# Altium project Metlino.PrjPcb (part 10 of 13)

## Sheet MCH_FPGA_Banks_44_45_46_DDR64.SchDoc: Metlino
size 420 x 297 mm; CheckedBy: P.Kulik,T.Przywozki,W.Ruclo; Author: G.Kasprowicz; CompanyName: WUT ISE; DrawnBy: G.Kasprowicz; Organization: WUT ISE; Address1: PW ISE; Address2: Nowowiejska 15/19 00-665 Warsaw; Address3: gkasprow@gmail.com; DocumentNumber: 3; Revision: 2; SheetNumber: 3; SheetTotal: 29; ModifiedBy: -; CheckedDate: -; Title2: FPGA banks -  SDRAM; DivGrp: WUT ISE; Designer: G.Kasprowicz; ModifiedDate: -; ProjectName: Sensor Box
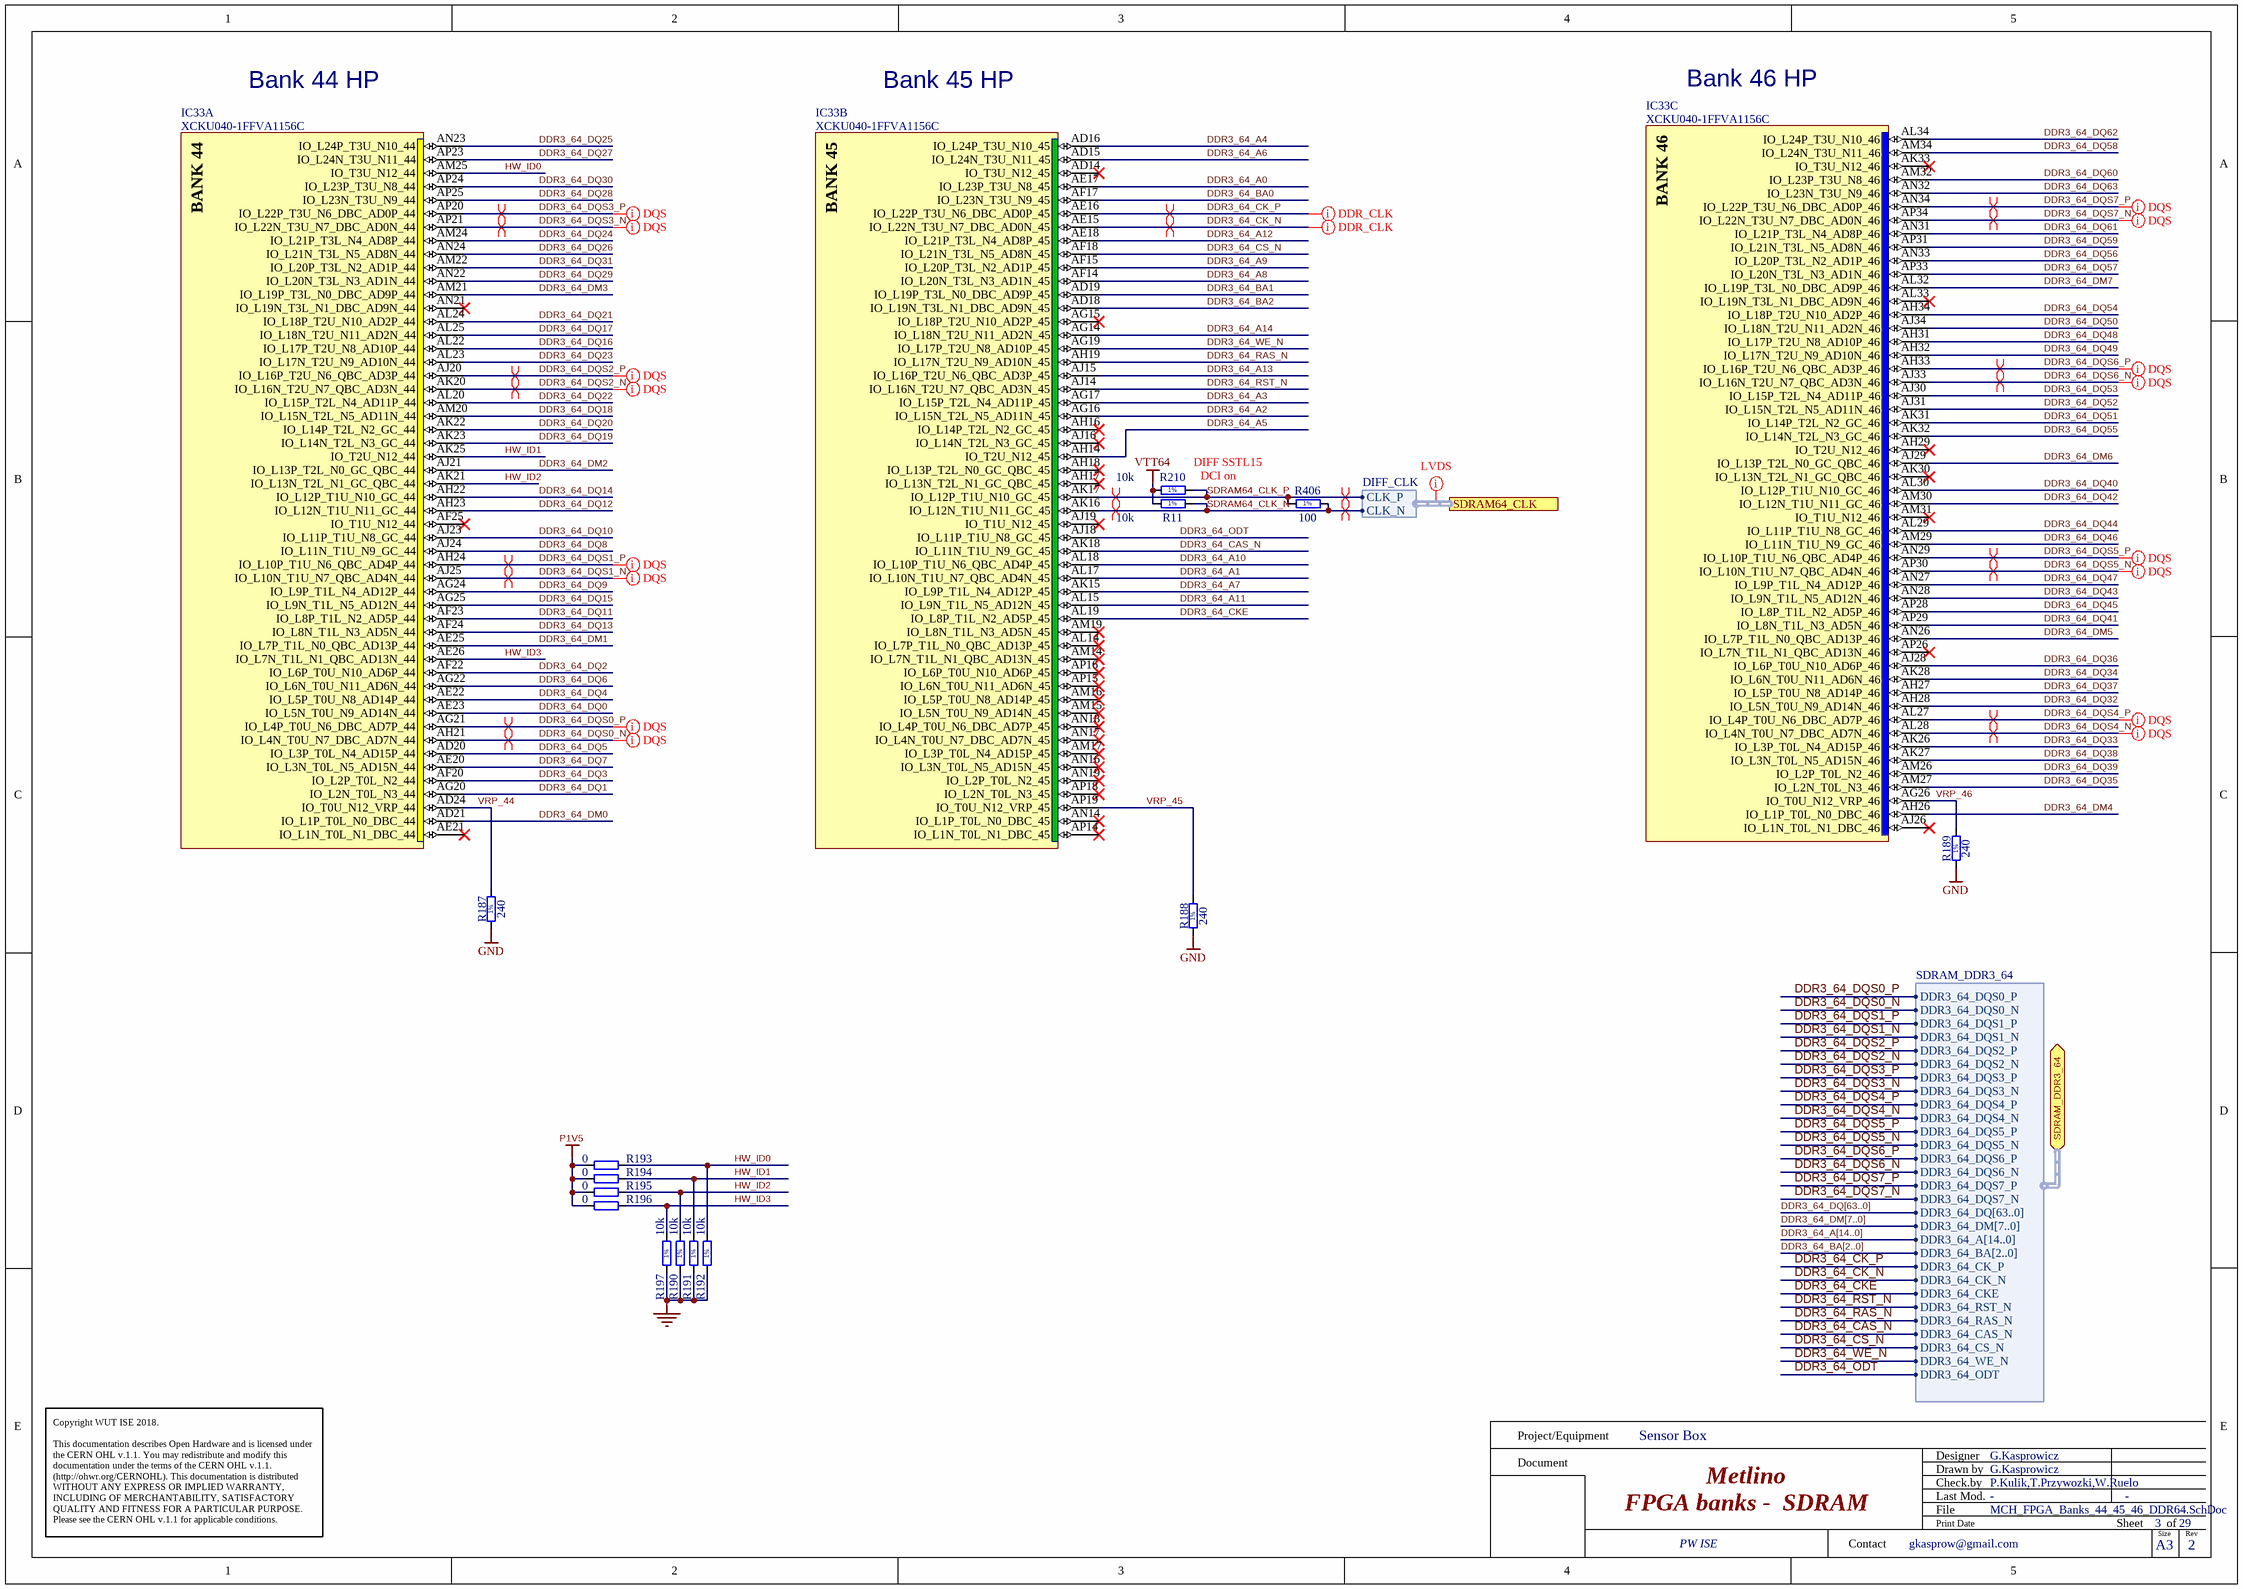
[diagram p20: MCH_FPGA_Banks_44_45_46_DDR64.SchDoc]

### Parts
IC33  XCKU040-1FFVA1156C  [BGA1156C100P34X34_3500X3500X350]  (parts A,B,C of 22)
R11  10k  [RESC1005X40N]
R187  240  [RESC1005X40N]
R188  240  [RESC1005X40N]
R189  240  [RESC1005X40N]
R190  10k  [RESC1005X40N]
R191  10k  [RESC1005X40N]
R192  10k  [RESC1005X40N]
R193  0  [RESC1005X40N]
R194  0  [RESC1005X40N]
R195  0  [RESC1005X40N]
R196  0  [RESC1005X40N]
R197  10k  [RESC1005X40N]
R210  10k  [RESC1005X40N]
R406  100  [RESC0603X28N]

### Ports
SDRAM64_CLK (harness DIFF_CLK), SDRAM_DDR3_64 (bidir, harness SDRAM_DDR3_64)

### Harnesses
SDRAM_DDR3_64: DDR3_64_DQS0_P, DDR3_64_DQS0_N, DDR3_64_DQS1_P, DDR3_64_DQS1_N, DDR3_64_DQS2_P, DDR3_64_DQS2_N, DDR3_64_DQS3_P, DDR3_64_DQS3_N, DDR3_64_DQS4_P, DDR3_64_DQS4_N, DDR3_64_DQS5_P, DDR3_64_DQS5_N, DDR3_64_DQS6_P, DDR3_64_DQS6_N, DDR3_64_DQS7_P, DDR3_64_DQS7_N, DDR3_64_DQ[63..0], DDR3_64_DM[7..0], DDR3_64_A[14..0], DDR3_64_BA[2..0], DDR3_64_CK_P, DDR3_64_CK_N, DDR3_64_CKE, DDR3_64_RST_N, DDR3_64_RAS_N, DDR3_64_CAS_N, DDR3_64_CS_N, DDR3_64_WE_N, DDR3_64_ODT
DIFF_CLK: CLK_N, CLK_P

### Nets
GND: R187.1 R188.1 R189.1 R190.1 R191.1 R192.1 R197.1
P1V5: R193.1 R194.1 R195.1 R196.1
VTT64: R11.1 R210.1
DDR3_64_A0: IC33.AE17(IO_L23P_T3U_N8_45)
DDR3_64_A1: IC33.AL17(IO_L10N_T1U_N7_QBC_AD4N_45)
DDR3_64_A2: IC33.AG16(IO_L15N_T2L_N5_AD11N_45)
DDR3_64_A3: IC33.AG17(IO_L15P_T2L_N4_AD11P_45)
DDR3_64_A4: IC33.AD16(IO_L24P_T3U_N10_45)
DDR3_64_A5: IC33.AH14(IO_T2U_N12_45)
DDR3_64_A6: IC33.AD15(IO_L24N_T3U_N11_45)
DDR3_64_A7: IC33.AK15(IO_L9P_T1L_N4_AD12P_45)
DDR3_64_A8: IC33.AF14(IO_L20N_T3L_N3_AD1N_45)
DDR3_64_A9: IC33.AF15(IO_L20P_T3L_N2_AD1P_45)
DDR3_64_A10: IC33.AL18(IO_L10P_T1U_N6_QBC_AD4P_45)
DDR3_64_A11: IC33.AL15(IO_L9N_T1L_N5_AD12N_45)
DDR3_64_A12: IC33.AE18(IO_L21P_T3L_N4_AD8P_45)
DDR3_64_A13: IC33.AJ15(IO_L16P_T2U_N6_QBC_AD3P_45)
DDR3_64_A14: IC33.AG14(IO_L18N_T2U_N11_AD2N_45)
DDR3_64_BA0: IC33.AF17(IO_L23N_T3U_N9_45)
DDR3_64_BA1: IC33.AD19(IO_L19P_T3L_N0_DBC_AD9P_45)
DDR3_64_BA2: IC33.AD18(IO_L19N_T3L_N1_DBC_AD9N_45)
DDR3_64_CAS_N: IC33.AK18(IO_L11N_T1U_N9_GC_45) ; port SDRAM_DDR3_64.DDR3_64_CAS_N
DDR3_64_CK_N: IC33.AE15(IO_L22N_T3U_N7_DBC_AD0N_45) ; port SDRAM_DDR3_64.DDR3_64_CK_N
DDR3_64_CK_P: IC33.AE16(IO_L22P_T3U_N6_DBC_AD0P_45) ; port SDRAM_DDR3_64.DDR3_64_CK_P
DDR3_64_CKE: IC33.AL19(IO_L8P_T1L_N2_AD5P_45) ; port SDRAM_DDR3_64.DDR3_64_CKE
DDR3_64_CS_N: IC33.AF18(IO_L21N_T3L_N5_AD8N_45) ; port SDRAM_DDR3_64.DDR3_64_CS_N
DDR3_64_DM0: IC33.AD21(IO_L1P_T0L_N0_DBC_44)
DDR3_64_DM1: IC33.AE25(IO_L7P_T1L_N0_QBC_AD13P_44)
DDR3_64_DM2: IC33.AJ21(IO_L13P_T2L_N0_GC_QBC_44)
DDR3_64_DM3: IC33.AM21(IO_L19P_T3L_N0_DBC_AD9P_44)
DDR3_64_DM4: IC33.AH26(IO_L1P_T0L_N0_DBC_46)
DDR3_64_DM5: IC33.AN26(IO_L7P_T1L_N0_QBC_AD13P_46)
DDR3_64_DM6: IC33.AJ29(IO_L13P_T2L_N0_GC_QBC_46)
DDR3_64_DM7: IC33.AL32(IO_L19P_T3L_N0_DBC_AD9P_46)
DDR3_64_DQ0: IC33.AE23(IO_L5N_T0U_N9_AD14N_44)
DDR3_64_DQ1: IC33.AG20(IO_L2N_T0L_N3_44)
DDR3_64_DQ2: IC33.AF22(IO_L6P_T0U_N10_AD6P_44)
DDR3_64_DQ3: IC33.AF20(IO_L2P_T0L_N2_44)
DDR3_64_DQ4: IC33.AE22(IO_L5P_T0U_N8_AD14P_44)
DDR3_64_DQ5: IC33.AD20(IO_L3P_T0L_N4_AD15P_44)
DDR3_64_DQ6: IC33.AG22(IO_L6N_T0U_N11_AD6N_44)
DDR3_64_DQ7: IC33.AE20(IO_L3N_T0L_N5_AD15N_44)
DDR3_64_DQ8: IC33.AJ24(IO_L11N_T1U_N9_GC_44)
DDR3_64_DQ9: IC33.AG24(IO_L9P_T1L_N4_AD12P_44)
DDR3_64_DQ10: IC33.AJ23(IO_L11P_T1U_N8_GC_44)
DDR3_64_DQ11: IC33.AF23(IO_L8P_T1L_N2_AD5P_44)
DDR3_64_DQ12: IC33.AH23(IO_L12N_T1U_N11_GC_44)
DDR3_64_DQ13: IC33.AF24(IO_L8N_T1L_N3_AD5N_44)
DDR3_64_DQ14: IC33.AH22(IO_L12P_T1U_N10_GC_44)
DDR3_64_DQ15: IC33.AG25(IO_L9N_T1L_N5_AD12N_44)
DDR3_64_DQ16: IC33.AL22(IO_L17P_T2U_N8_AD10P_44)
DDR3_64_DQ17: IC33.AL25(IO_L18N_T2U_N11_AD2N_44)
DDR3_64_DQ18: IC33.AM20(IO_L15N_T2L_N5_AD11N_44)
DDR3_64_DQ19: IC33.AK23(IO_L14N_T2L_N3_GC_44)
DDR3_64_DQ20: IC33.AK22(IO_L14P_T2L_N2_GC_44)
DDR3_64_DQ21: IC33.AL24(IO_L18P_T2U_N10_AD2P_44)
DDR3_64_DQ22: IC33.AL20(IO_L15P_T2L_N4_AD11P_44)
DDR3_64_DQ23: IC33.AL23(IO_L17N_T2U_N9_AD10N_44)
DDR3_64_DQ24: IC33.AM24(IO_L21P_T3L_N4_AD8P_44)
DDR3_64_DQ25: IC33.AN23(IO_L24P_T3U_N10_44)
DDR3_64_DQ26: IC33.AN24(IO_L21N_T3L_N5_AD8N_44)
DDR3_64_DQ27: IC33.AP23(IO_L24N_T3U_N11_44)
DDR3_64_DQ28: IC33.AP25(IO_L23N_T3U_N9_44)
DDR3_64_DQ29: IC33.AN22(IO_L20N_T3L_N3_AD1N_44)
DDR3_64_DQ30: IC33.AP24(IO_L23P_T3U_N8_44)
DDR3_64_DQ31: IC33.AM22(IO_L20P_T3L_N2_AD1P_44)
DDR3_64_DQ32: IC33.AH28(IO_L5N_T0U_N9_AD14N_46)
DDR3_64_DQ33: IC33.AK26(IO_L3P_T0L_N4_AD15P_46)
DDR3_64_DQ34: IC33.AK28(IO_L6N_T0U_N11_AD6N_46)
DDR3_64_DQ35: IC33.AM27(IO_L2N_T0L_N3_46)
DDR3_64_DQ36: IC33.AJ28(IO_L6P_T0U_N10_AD6P_46)
DDR3_64_DQ37: IC33.AH27(IO_L5P_T0U_N8_AD14P_46)
DDR3_64_DQ38: IC33.AK27(IO_L3N_T0L_N5_AD15N_46)
DDR3_64_DQ39: IC33.AM26(IO_L2P_T0L_N2_46)
DDR3_64_DQ40: IC33.AL30(IO_L12P_T1U_N10_GC_46)
DDR3_64_DQ41: IC33.AP29(IO_L8N_T1L_N3_AD5N_46)
DDR3_64_DQ42: IC33.AM30(IO_L12N_T1U_N11_GC_46)
DDR3_64_DQ43: IC33.AN28(IO_L9N_T1L_N5_AD12N_46)
DDR3_64_DQ44: IC33.AL29(IO_L11P_T1U_N8_GC_46)
DDR3_64_DQ45: IC33.AP28(IO_L8P_T1L_N2_AD5P_46)
DDR3_64_DQ46: IC33.AM29(IO_L11N_T1U_N9_GC_46)
DDR3_64_DQ47: IC33.AN27(IO_L9P_T1L_N4_AD12P_46)
DDR3_64_DQ48: IC33.AH31(IO_L17P_T2U_N8_AD10P_46)
DDR3_64_DQ49: IC33.AH32(IO_L17N_T2U_N9_AD10N_46)
DDR3_64_DQ50: IC33.AJ34(IO_L18N_T2U_N11_AD2N_46)
DDR3_64_DQ51: IC33.AK31(IO_L14P_T2L_N2_GC_46)
DDR3_64_DQ52: IC33.AJ31(IO_L15N_T2L_N5_AD11N_46)
DDR3_64_DQ53: IC33.AJ30(IO_L15P_T2L_N4_AD11P_46)
DDR3_64_DQ54: IC33.AH34(IO_L18P_T2U_N10_AD2P_46)
DDR3_64_DQ55: IC33.AK32(IO_L14N_T2L_N3_GC_46)
DDR3_64_DQ56: IC33.AN33(IO_L20P_T3L_N2_AD1P_46)
DDR3_64_DQ57: IC33.AP33(IO_L20N_T3L_N3_AD1N_46)
DDR3_64_DQ58: IC33.AM34(IO_L24N_T3U_N11_46)
DDR3_64_DQ59: IC33.AP31(IO_L21N_T3L_N5_AD8N_46)
DDR3_64_DQ60: IC33.AM32(IO_L23P_T3U_N8_46)
DDR3_64_DQ61: IC33.AN31(IO_L21P_T3L_N4_AD8P_46)
DDR3_64_DQ62: IC33.AL34(IO_L24P_T3U_N10_46)
DDR3_64_DQ63: IC33.AN32(IO_L23N_T3U_N9_46)
DDR3_64_DQS0_N: IC33.AH21(IO_L4N_T0U_N7_DBC_AD7N_44) ; port SDRAM_DDR3_64.DDR3_64_DQS0_N
DDR3_64_DQS0_P: IC33.AG21(IO_L4P_T0U_N6_DBC_AD7P_44) ; port SDRAM_DDR3_64.DDR3_64_DQS0_P
DDR3_64_DQS1_N: IC33.AJ25(IO_L10N_T1U_N7_QBC_AD4N_44) ; port SDRAM_DDR3_64.DDR3_64_DQS1_N
DDR3_64_DQS1_P: IC33.AH24(IO_L10P_T1U_N6_QBC_AD4P_44) ; port SDRAM_DDR3_64.DDR3_64_DQS1_P
DDR3_64_DQS2_N: IC33.AK20(IO_L16N_T2U_N7_QBC_AD3N_44) ; port SDRAM_DDR3_64.DDR3_64_DQS2_N
DDR3_64_DQS2_P: IC33.AJ20(IO_L16P_T2U_N6_QBC_AD3P_44) ; port SDRAM_DDR3_64.DDR3_64_DQS2_P
DDR3_64_DQS3_N: IC33.AP21(IO_L22N_T3U_N7_DBC_AD0N_44) ; port SDRAM_DDR3_64.DDR3_64_DQS3_N
DDR3_64_DQS3_P: IC33.AP20(IO_L22P_T3U_N6_DBC_AD0P_44) ; port SDRAM_DDR3_64.DDR3_64_DQS3_P
DDR3_64_DQS4_N: IC33.AL28(IO_L4N_T0U_N7_DBC_AD7N_46) ; port SDRAM_DDR3_64.DDR3_64_DQS4_N
DDR3_64_DQS4_P: IC33.AL27(IO_L4P_T0U_N6_DBC_AD7P_46) ; port SDRAM_DDR3_64.DDR3_64_DQS4_P
DDR3_64_DQS5_N: IC33.AP30(IO_L10N_T1U_N7_QBC_AD4N_46) ; port SDRAM_DDR3_64.DDR3_64_DQS5_N
DDR3_64_DQS5_P: IC33.AN29(IO_L10P_T1U_N6_QBC_AD4P_46) ; port SDRAM_DDR3_64.DDR3_64_DQS5_P
DDR3_64_DQS6_N: IC33.AJ33(IO_L16N_T2U_N7_QBC_AD3N_46) ; port SDRAM_DDR3_64.DDR3_64_DQS6_N
DDR3_64_DQS6_P: IC33.AH33(IO_L16P_T2U_N6_QBC_AD3P_46) ; port SDRAM_DDR3_64.DDR3_64_DQS6_P
DDR3_64_DQS7_N: IC33.AP34(IO_L22N_T3U_N7_DBC_AD0N_46) ; port SDRAM_DDR3_64.DDR3_64_DQS7_N
DDR3_64_DQS7_P: IC33.AN34(IO_L22P_T3U_N6_DBC_AD0P_46) ; port SDRAM_DDR3_64.DDR3_64_DQS7_P
DDR3_64_ODT: IC33.AJ18(IO_L11P_T1U_N8_GC_45) ; port SDRAM_DDR3_64.DDR3_64_ODT
DDR3_64_RAS_N: IC33.AH19(IO_L17N_T2U_N9_AD10N_45) ; port SDRAM_DDR3_64.DDR3_64_RAS_N
DDR3_64_RST_N: IC33.AJ14(IO_L16N_T2U_N7_QBC_AD3N_45) ; port SDRAM_DDR3_64.DDR3_64_RST_N
DDR3_64_WE_N: IC33.AG19(IO_L17P_T2U_N8_AD10P_45) ; port SDRAM_DDR3_64.DDR3_64_WE_N
HW_ID0: IC33.AM25(IO_T3U_N12_44) R192.2 R193.2
HW_ID1: IC33.AK25(IO_T2U_N12_44) R191.2 R194.2
HW_ID2: IC33.AK21(IO_L13N_T2L_N1_GC_QBC_44) R190.2 R195.2
HW_ID3: IC33.AE26(IO_L7N_T1L_N1_QBC_AD13N_44) R196.2 R197.2
SDRAM64_CLK_N: IC33.AK16(IO_L12N_T1U_N11_GC_45) R11.2 R406.2 ; port SDRAM64_CLK.CLK_N
SDRAM64_CLK_P: IC33.AK17(IO_L12P_T1U_N10_GC_45) R210.2 R406.1 ; port SDRAM64_CLK.CLK_P
VRP_44: IC33.AD24(IO_T0U_N12_VRP_44) R187.2
VRP_45: IC33.AP19(IO_T0U_N12_VRP_45) R188.2
VRP_46: IC33.AG26(IO_T0U_N12_VRP_46) R189.2

Not connected (* = marked no-connect by the designer): IC33 AD14(IO_T3U_N12_45)* AE21(IO_L1N_T0L_N1_DBC_44)* AF25(IO_T1U_N12_44)* AG15(IO_L18P_T2U_N10_AD2P_45)* AH16(IO_L14P_T2L_N2_GC_45)* AH17(IO_L13N_T2L_N1_GC_QBC_45)* AH18(IO_L13P_T2L_N0_GC_QBC_45)* AH29(IO_T2U_N12_46)* AJ16(IO_L14N_T2L_N3_GC_45)* AJ19(IO_T1U_N12_45)* AJ26(IO_L1N_T0L_N1_DBC_46)* AK30(IO_L13N_T2L_N1_GC_QBC_46)* AK33(IO_T3U_N12_46)* AL14(IO_L7P_T1L_N0_QBC_AD13P_45)* AL33(IO_L19N_T3L_N1_DBC_AD9N_46)* AM14(IO_L7N_T1L_N1_QBC_AD13N_45)* AM15(IO_L5N_T0U_N9_AD14N_45)* AM16(IO_L5P_T0U_N8_AD14P_45)* AM17(IO_L3P_T0L_N4_AD15P_45)* AM19(IO_L8N_T1L_N3_AD5N_45)* AM31(IO_T1U_N12_46)* AN14(IO_L1P_T0L_N0_DBC_45)* AN16(IO_L3N_T0L_N5_AD15N_45)* AN17(IO_L4N_T0U_N7_DBC_AD7N_45)* AN18(IO_L4P_T0U_N6_DBC_AD7P_45)* AN19(IO_L2P_T0L_N2_45)* AN21(IO_L19N_T3L_N1_DBC_AD9N_44)* AP14(IO_L1N_T0L_N1_DBC_45)* AP15(IO_L6N_T0U_N11_AD6N_45)* AP16(IO_L6P_T0U_N10_AD6P_45)* AP18(IO_L2N_T0L_N3_45)* AP26(IO_L7N_T1L_N1_QBC_AD13N_46)*

### Buses and harness runs
bus DDR3_64_A[14..0]
bus DDR3_64_BA[2..0]
bus DDR3_64_DM[7..0]
bus DDR3_64_DQ[63..0]

### Layout directives
net class DQS: DDR3_64_DQS0_N, DDR3_64_DQS0_P, DDR3_64_DQS1_N, DDR3_64_DQS1_P, DDR3_64_DQS2_N, DDR3_64_DQS2_P, DDR3_64_DQS3_N, DDR3_64_DQS3_P, DDR3_64_DQS4_N, DDR3_64_DQS4_P, DDR3_64_DQS5_N, DDR3_64_DQS5_P, DDR3_64_DQS6_N, DDR3_64_DQS6_P, DDR3_64_DQS7_N, DDR3_64_DQS7_P
differential pair: DDR3_64_CK_N, DDR3_64_CK_P, DDR3_64_DQS0_N, DDR3_64_DQS0_P, DDR3_64_DQS1_N, DDR3_64_DQS1_P, DDR3_64_DQS2_N, DDR3_64_DQS2_P, DDR3_64_DQS3_N, DDR3_64_DQS3_P, DDR3_64_DQS4_N, DDR3_64_DQS4_P, DDR3_64_DQS5_N, DDR3_64_DQS5_P, DDR3_64_DQS6_N, DDR3_64_DQS6_P, DDR3_64_DQS7_N, DDR3_64_DQS7_P, SDRAM64_CLK_N, SDRAM64_CLK_P
net class LVDS: (no net found under the mark)
net class DDR_CLK: DDR3_64_CK_N, DDR3_64_CK_P

### Notes on the sheet
- Bank 44 HP
- Bank 45 HP
- Bank 46 HP
- DIFF SSTL15
- DCI on
- Project/Equipment
- Document
- Designer
- Drawn by
- Check.by
- Copyright WUT ISE 2018.
  This documentation describes Open Hardware and is licensed under the CERN OHL v.1.1. You may redistribute and modify this documentation under the terms of the CERN OHL v.1.1. (http://ohwr.org/CERNOHL). This documentation is distributed WITHOUT ANY EXPRESS OR IMPLIED WARRANTY, INCLUDING OF MERCHANTABILITY, SATISFACTORY QUALITY AND FITNESS FOR A PARTICULAR PURPOSE. Please see the CERN OHL v.1.1 for applicable conditions.
- Contact
- File
- Last Mod.
- Print Date
- Sheet
- Size
- A3
- of
- Rev
- (in symbol R0201_100R_1%_0.05W_200PPM) 1%
- (in symbol R0402_10K_1%_0.0625W_100PPM) 1%
- (in symbol R0402_240R_1%_0.0625W_100PPM) 1%
- (in symbol XCKU040-1FFVA1156C, part A) BANK 44
- (in symbol XCKU040-1FFVA1156C, part B) BANK 45
- (in symbol XCKU040-1FFVA1156C, part C) BANK 46

### Library data of the parts
IC33 = XCKU040-1FFVA1156C: Kintex UltraScale FPGA, 520 I/O, 530K Cells, 1156-Ball BGA, Speed Grade 1, Commercial Grade; Manufacturer: XILINX; Part Description: Kintex UltraScale, 40 DLL I/O, 416 HP I/O, 104 HR I/O, 1156-Pin BGA, Speed Grade 1, Commercial Grade; PressFit: No; Bonding: No; Manufacturer Part Number: XCKU040-1FFVA1156C; PackageDescription: BGA, 1.00mm Pitch, Square; 1156 Pin, 34 Columns X 34 Rows, Body 35.00mm X 35.00mm X 3.50mm H, IPC Medium Density; Part Number: XCKU040-1FFVA1156C; Component Kind: Standard; Component Type: Standard; Device: XCKU040-1FFVA1156C; Pin Count: 1156; Case: BGA1156; Mounted: Yes; Socket: No; SMD: Yes; Sense: No; ComponentHeight: 3.5mm; HelpURL: \\cern.ch\dfs\Applications\Altium\Datasheets\XCKU040-1FFVA1156C.pdf; ComponentLink1URL: \\cern.ch\dfs\Applications\Altium\Datasheets\XCKU040-1FFVA1156C_Package-Pinout.pdf; ComponentLink1Description: Package/Pinout; Author: CERN DEM CA; CreateDate: 16.08.2016; LatestRevisionDate: 16.08.2016
R11 R190-R192 R197 R210 = R0402_10K_1%_0.0625W_100PPM: Resistor - 1%; Manufacturer: GENERIC; Part Description: General Purpose Thick Film Chip Resistor; Manufacturer1 Part Number: 232270671003L; TC: ±100ppm/°C; PressFit: No; Manufacturer Part Number: R0402_10K_1%_0.0625W_100PPM; Part Number: R0402_10K_1%_0.0625W_100PPM; Tolerance: ±1%; Value: 10k; Component Kind: Standard; Component Type: Standard; Pin Count: 2; Status: Not Recommended; Power: 0.0625W; Case: 0402; Mounted: Yes; Sense: No; Socket: No; SMD: Yes; Manufacturer1 Example: YAGEO PHYCOMP; Manufacturer1 ComponentHeight: 0.4mm; HelpURL: \\cern.ch\dfs\Applications\Altium\Datasheets\R0402_Phycomp_RC0402.pdf; Author: CERN DEM JLC; CreateDate: 03.12.2007; LatestRevisionDate: 17.10.2012
R187-R189 = R0402_240R_1%_0.0625W_100PPM: Resistor - 1%; Manufacturer: GENERIC; Part Description: General Purpose Thick Film Chip Resistor; Manufacturer1 Part Number: 232270672401L; TC: ±100ppm/°C; PressFit: No; Manufacturer Part Number: R0402_240R_1%_0.0625W_100PPM; Part Number: R0402_240R_1%_0.0625W_100PPM; Tolerance: ±1%; Value: 240; Component Kind: Standard; Component Type: Standard; Pin Count: 2; Status: Not Recommended; Power: 0.0625W; Case: 0402; Mounted: Yes; Sense: No; Socket: No; SMD: Yes; Manufacturer1 Example: YAGEO PHYCOMP; Manufacturer1 ComponentHeight: 0.4mm; HelpURL: \\cern.ch\dfs\Applications\Altium\Datasheets\R0402_Phycomp_RC0402.pdf; Author: CERN DEM JLC; CreateDate: 03.12.2007; LatestRevisionDate: 17.10.2012
R193-R196 = R0402_0R_JUMPER: Resistor; Manufacturer: GENERIC; Part Description: 1A (0.05R Max DC Resistance) Zero Ohm Jumper; Manufacturer1 Part Number: 232270591001L; PressFit: No; Manufacturer Part Number: R0402_0R_JUMPER; Part Number: R0402_0R_JUMPER; Value: 0; Component Kind: Standard; Component Type: Standard; Pin Count: 2; Status: Not Recommended; Case: 0402; Mounted: Yes; Sense: No; Socket: No; SMD: Yes; Manufacturer1 Example: YAGEO PHYCOMP; Manufacturer1 ComponentHeight: 0.4mm; HelpURL: \\cern.ch\dfs\Applications\Altium\Datasheets\R0402_Phycomp_RC0402.pdf; Author: CERN DEM JLC; CreateDate: 03.12.2007; LatestRevisionDate: 17.10.2012
R406 = R0201_100R_1%_0.05W_200PPM: Resistor - 1%; Manufacturer: GENERIC; Part Description: Thick Film Chip Resistor; Manufacturer1 Part Number: CRCW0201100RFNED; Power: 0.05W; TC: ±200ppm/°C; PressFit: No; Manufacturer Part Number: R0201_100R_1%_0.05W_200PPM; Part Number: R0201_100R_1%_0.05W_200PPM; Tolerance: ±1%; Value: 100; Component Kind: Standard; Component Type: Standard; Pin Count: 2; Status: Not Recommended; Case: 0201; Mounted: Yes; Sense: No; Socket: No; SMD: Yes; Manufacturer1 Example: VISHAY; Manufacturer1 ComponentHeight: 0.27mm; HelpURL: \\cern.ch\dfs\Applications\Altium\Datasheets\R0201_VISHAY_CRCW0201 e3.pdf; Author: CERN DEM JLC; CreateDate: 13.11.2014; LatestRevisionDate: 13.11.2014

## Sheet MCH_FPGA_Banks_64_65_HR.SchDoc: Metlino
size 420 x 297 mm; CheckedBy: P.Kulik,T.Przywozki,W.Ruclo; Author: G.Kasprowicz; CompanyName: WUT ISE; DrawnBy: G.Kasprowicz; Organization: WUT ISE; Address1: PW ISE; Address2: Nowowiejska 15/19 00-665 Warsaw; Address3: gkasprow@gmail.com; DocumentNumber: 6; Revision: 2; SheetNumber: 6; SheetTotal: 29; ModifiedBy: -; CheckedDate: -; Title2: FPGA banks - SFP, Eth, Misc; DivGrp: WUT ISE; Designer: G.Kasprowicz; ModifiedDate: -; ProjectName: Sensor Box
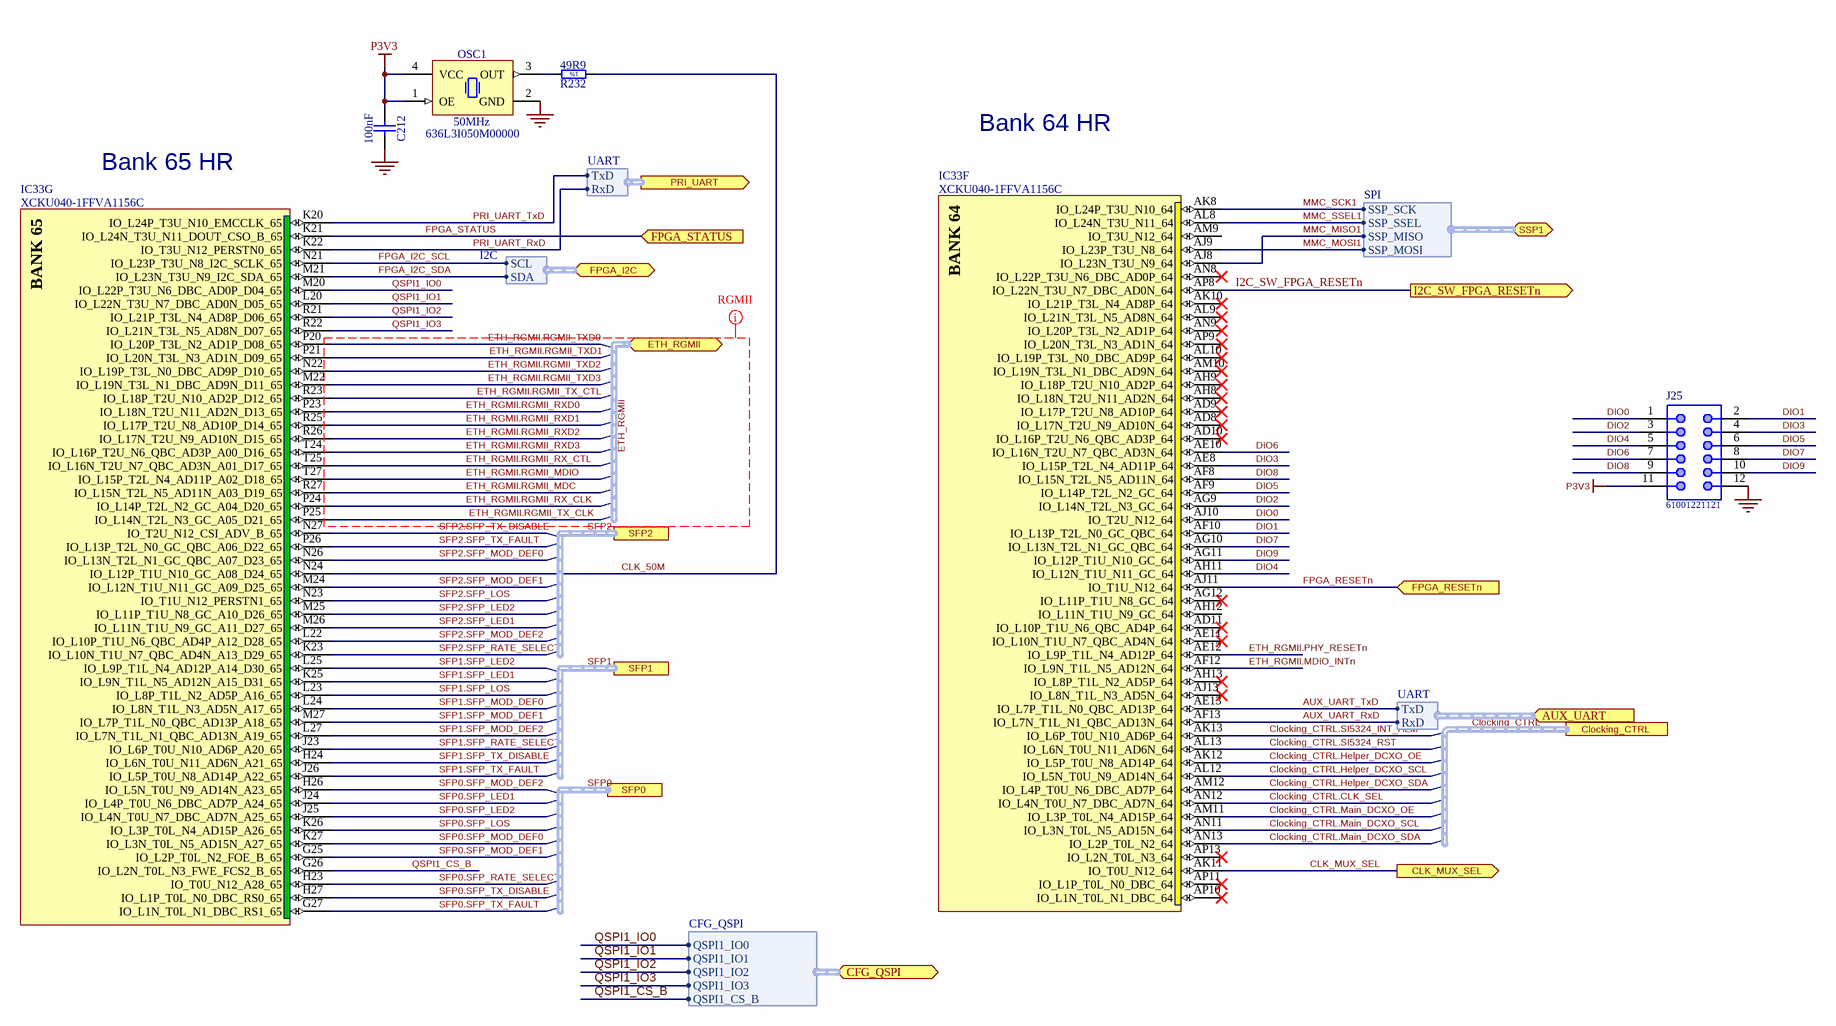
[diagram p21: MCH_FPGA_Banks_64_65_HR.SchDoc]

### Parts
C212  100nF  [CAPC0603X33N]
IC33  XCKU040-1FFVA1156C  [BGA1156C100P34X34_3500X3500X350]  (parts F,G of 22)
J25  61001221121  [61001221121]
OSC1  50MHz  Manufacturer Part Number: 636L3I050M00000  [OSCSC254P320X500X130-4N]
R232  49R9  [RESC1005X40N]

### Ports
AUX_UART (in, harness UART), CFG_QSPI (bidir, harness CFG_QSPI), CLK_MUX_SEL (out), Clocking_CTRL (harness WR_I2C_CTRL), ETH_RGMII (bidir, harness ETH_RGMII), FPGA_I2C (bidir, harness I2C), FPGA_RESETn (in), FPGA_STATUS (in), I2C_SW_FPGA_RESETn (out), PRI_UART (out, harness UART), SFP0 (harness SFP_CTL), SFP1 (harness SFP_CTL), SFP2 (harness SFP_CTL), SSP1 (bidir, harness SPI)

### Harnesses
CFG_QSPI: QSPI1_IO0, QSPI1_IO1, QSPI1_IO2, QSPI1_IO3, QSPI1_CS_B
SPI: SSP_SCK, SSP_SSEL, SSP_MISO, SSP_MOSI
UART: RxD, TxD
I2C: SCL, SDA

### Nets
GND: C212.1 J25.12 OSC1.2(GND)
P3V3: C212.2 J25.11 OSC1.1(OE) OSC1.4(VCC)
AUX_UART_RxD: IC33.AF13(IO_L7N_T1L_N1_QBC_AD13N_64) ; port AUX_UART.RxD
AUX_UART_TxD: IC33.AE13(IO_L7P_T1L_N0_QBC_AD13P_64) ; port AUX_UART.TxD
CLK_50M: IC33.N24(IO_L12P_T1U_N10_GC_A08_D24_65) R232.1
CLK_MUX_SEL: IC33.AK11(IO_T0U_N12_64) ; port CLK_MUX_SEL
Clocking_CTRL.CLK_SEL: IC33.AN12(IO_L4N_T0U_N7_DBC_AD7N_64)
Clocking_CTRL.Helper_DCXO_OE: IC33.AK12(IO_L5P_T0U_N8_AD14P_64)
Clocking_CTRL.Helper_DCXO_SCL: IC33.AL12(IO_L5N_T0U_N9_AD14N_64)
Clocking_CTRL.Helper_DCXO_SDA: IC33.AM12(IO_L4P_T0U_N6_DBC_AD7P_64)
Clocking_CTRL.Main_DCXO_OE: IC33.AM11(IO_L3P_T0L_N4_AD15P_64)
Clocking_CTRL.Main_DCXO_SCL: IC33.AN11(IO_L3N_T0L_N5_AD15N_64)
Clocking_CTRL.Main_DCXO_SDA: IC33.AN13(IO_L2P_T0L_N2_64)
Clocking_CTRL.SI5324_INT_ALM: IC33.AK13(IO_L6P_T0U_N10_AD6P_64)
Clocking_CTRL.SI5324_RST: IC33.AL13(IO_L6N_T0U_N11_AD6N_64)
DIO0: IC33.AJ10(IO_T2U_N12_64) J25.1
DIO1: IC33.AF10(IO_L13P_T2L_N0_GC_QBC_64) J25.2
DIO2: IC33.AG9(IO_L14N_T2L_N3_GC_64) J25.3
DIO3: IC33.AE8(IO_L15P_T2L_N4_AD11P_64) J25.4
DIO4: IC33.AH11(IO_L12N_T1U_N11_GC_64) J25.5
DIO5: IC33.AF9(IO_L14P_T2L_N2_GC_64) J25.6
DIO6: IC33.AE10(IO_L16N_T2U_N7_QBC_AD3N_64) J25.7
DIO7: IC33.AG10(IO_L13N_T2L_N1_GC_QBC_64) J25.8
DIO8: IC33.AF8(IO_L15N_T2L_N5_AD11N_64) J25.9
DIO9: IC33.AG11(IO_L12P_T1U_N10_GC_64) J25.10
ETH_RGMII.MDIO_INTn: IC33.AF12(IO_L9N_T1L_N5_AD12N_64)
ETH_RGMII.PHY_RESETn: IC33.AE12(IO_L9P_T1L_N4_AD12P_64)
ETH_RGMII.RGMII_MDC: IC33.R27(IO_L15N_T2L_N5_AD11N_A03_D19_65)
ETH_RGMII.RGMII_MDIO: IC33.T27(IO_L15P_T2L_N4_AD11P_A02_D18_65)
ETH_RGMII.RGMII_RX_CLK: IC33.P24(IO_L14P_T2L_N2_GC_A04_D20_65)
ETH_RGMII.RGMII_RX_CTL: IC33.T25(IO_L16N_T2U_N7_QBC_AD3N_A01_D17_65)
ETH_RGMII.RGMII_RXD0: IC33.P23(IO_L18N_T2U_N11_AD2N_D13_65)
ETH_RGMII.RGMII_RXD1: IC33.R25(IO_L17P_T2U_N8_AD10P_D14_65)
ETH_RGMII.RGMII_RXD2: IC33.R26(IO_L17N_T2U_N9_AD10N_D15_65)
ETH_RGMII.RGMII_RXD3: IC33.T24(IO_L16P_T2U_N6_QBC_AD3P_A00_D16_65)
ETH_RGMII.RGMII_TX_CLK: IC33.P25(IO_L14N_T2L_N3_GC_A05_D21_65)
ETH_RGMII.RGMII_TX_CTL: IC33.R23(IO_L18P_T2U_N10_AD2P_D12_65)
ETH_RGMII.RGMII_TXD0: IC33.P20(IO_L20P_T3L_N2_AD1P_D08_65)
ETH_RGMII.RGMII_TXD1: IC33.P21(IO_L20N_T3L_N3_AD1N_D09_65)
ETH_RGMII.RGMII_TXD2: IC33.N22(IO_L19P_T3L_N0_DBC_AD9P_D10_65)
ETH_RGMII.RGMII_TXD3: IC33.M22(IO_L19N_T3L_N1_DBC_AD9N_D11_65)
FPGA_I2C_SCL: IC33.N21(IO_L23P_T3U_N8_I2C_SCLK_65) ; port FPGA_I2C.SCL
FPGA_I2C_SDA: IC33.M21(IO_L23N_T3U_N9_I2C_SDA_65) ; port FPGA_I2C.SDA
FPGA_RESETn: IC33.AJ11(IO_T1U_N12_64) ; port FPGA_RESETn
FPGA_STATUS: IC33.K21(IO_L24N_T3U_N11_DOUT_CSO_B_65) ; port FPGA_STATUS
I2C_SW_FPGA_RESETn: IC33.AP8(IO_L22N_T3U_N7_DBC_AD0N_64) ; port I2C_SW_FPGA_RESETn
MMC_MISO1: IC33.AJ8(IO_L23N_T3U_N9_64) ; port SSP1.SSP_MISO
MMC_MOSI1: IC33.AJ9(IO_L23P_T3U_N8_64) ; port SSP1.SSP_MOSI
MMC_SCK1: IC33.AK8(IO_L24P_T3U_N10_64) ; port SSP1.SSP_SCK
MMC_SSEL1: IC33.AL8(IO_L24N_T3U_N11_64) ; port SSP1.SSP_SSEL
PRI_UART_RxD: IC33.K22(IO_T3U_N12_PERSTN0_65) ; port PRI_UART.RxD
PRI_UART_TxD: IC33.K20(IO_L24P_T3U_N10_EMCCLK_65) ; port PRI_UART.TxD
QSPI1_CS_B: IC33.G26(IO_L2N_T0L_N3_FWE_FCS2_B_65) ; port CFG_QSPI.QSPI1_CS_B
QSPI1_IO0: IC33.M20(IO_L22P_T3U_N6_DBC_AD0P_D04_65) ; port CFG_QSPI.QSPI1_IO0
QSPI1_IO1: IC33.L20(IO_L22N_T3U_N7_DBC_AD0N_D05_65) ; port CFG_QSPI.QSPI1_IO1
QSPI1_IO2: IC33.R21(IO_L21P_T3L_N4_AD8P_D06_65) ; port CFG_QSPI.QSPI1_IO2
QSPI1_IO3: IC33.R22(IO_L21N_T3L_N5_AD8N_D07_65) ; port CFG_QSPI.QSPI1_IO3
SFP0.SFP_LED1: IC33.J24(IO_L4P_T0U_N6_DBC_AD7P_A24_65)
SFP0.SFP_LED2: IC33.J25(IO_L4N_T0U_N7_DBC_AD7N_A25_65)
SFP0.SFP_LOS: IC33.K26(IO_L3P_T0L_N4_AD15P_A26_65)
SFP0.SFP_MOD_DEF0: IC33.K27(IO_L3N_T0L_N5_AD15N_A27_65)
SFP0.SFP_MOD_DEF1: IC33.G25(IO_L2P_T0L_N2_FOE_B_65)
SFP0.SFP_MOD_DEF2: IC33.H26(IO_L5N_T0U_N9_AD14N_A23_65)
SFP0.SFP_RATE_SELECT: IC33.H23(IO_T0U_N12_A28_65)
SFP0.SFP_TX_DISABLE: IC33.H27(IO_L1P_T0L_N0_DBC_RS0_65)
SFP0.SFP_TX_FAULT: IC33.G27(IO_L1N_T0L_N1_DBC_RS1_65)
SFP1.SFP_LED1: IC33.K25(IO_L9N_T1L_N5_AD12N_A15_D31_65)
SFP1.SFP_LED2: IC33.L25(IO_L9P_T1L_N4_AD12P_A14_D30_65)
SFP1.SFP_LOS: IC33.L23(IO_L8P_T1L_N2_AD5P_A16_65)
SFP1.SFP_MOD_DEF0: IC33.L24(IO_L8N_T1L_N3_AD5N_A17_65)
SFP1.SFP_MOD_DEF1: IC33.M27(IO_L7P_T1L_N0_QBC_AD13P_A18_65)
SFP1.SFP_MOD_DEF2: IC33.L27(IO_L7N_T1L_N1_QBC_AD13N_A19_65)
SFP1.SFP_RATE_SELECT: IC33.J23(IO_L6P_T0U_N10_AD6P_A20_65)
SFP1.SFP_TX_DISABLE: IC33.H24(IO_L6N_T0U_N11_AD6N_A21_65)
SFP1.SFP_TX_FAULT: IC33.J26(IO_L5P_T0U_N8_AD14P_A22_65)
SFP2.SFP_LED1: IC33.M26(IO_L11N_T1U_N9_GC_A11_D27_65)
SFP2.SFP_LED2: IC33.M25(IO_L11P_T1U_N8_GC_A10_D26_65)
SFP2.SFP_LOS: IC33.N23(IO_T1U_N12_PERSTN1_65)
SFP2.SFP_MOD_DEF0: IC33.N26(IO_L13N_T2L_N1_GC_QBC_A07_D23_65)
SFP2.SFP_MOD_DEF1: IC33.M24(IO_L12N_T1U_N11_GC_A09_D25_65)
SFP2.SFP_MOD_DEF2: IC33.L22(IO_L10P_T1U_N6_QBC_AD4P_A12_D28_65)
SFP2.SFP_RATE_SELECT: IC33.K23(IO_L10N_T1U_N7_QBC_AD4N_A13_D29_65)
SFP2.SFP_TX_DISABLE: IC33.N27(IO_T2U_N12_CSI_ADV_B_65)
SFP2.SFP_TX_FAULT: IC33.P26(IO_L13P_T2L_N0_GC_QBC_A06_D22_65)
NetOSC1_3: OSC1.3(OUT) R232.2

Not connected (* = marked no-connect by the designer): IC33 AD8(IO_L17N_T2U_N9_AD10N_64)* AD9(IO_L17P_T2U_N8_AD10P_64)* AD10(IO_L16P_T2U_N6_QBC_AD3P_64)* AD11(IO_L10P_T1U_N6_QBC_AD4P_64)* AE11(IO_L10N_T1U_N7_QBC_AD4N_64)* AG12(IO_L11P_T1U_N8_GC_64)* AH8(IO_L18N_T2U_N11_AD2N_64)* AH9(IO_L18P_T2U_N10_AD2P_64)* AH12(IO_L11N_T1U_N9_GC_64) AH13(IO_L8P_T1L_N2_AD5P_64)* AJ13(IO_L8N_T1L_N3_AD5N_64)* AK10(IO_L21P_T3L_N4_AD8P_64)* AL9(IO_L21N_T3L_N5_AD8N_64)* AL10(IO_L19P_T3L_N0_DBC_AD9P_64)* AM9(IO_T3U_N12_64) AM10(IO_L19N_T3L_N1_DBC_AD9N_64)* AN8(IO_L22P_T3U_N6_DBC_AD0P_64)* AN9(IO_L20P_T3L_N2_AD1P_64)* AP9(IO_L20N_T3L_N3_AD1N_64)* AP10(IO_L1N_T0L_N1_DBC_64)* AP11(IO_L1P_T0L_N0_DBC_64)* AP13(IO_L2N_T0L_N3_64)*

### Buses and harness runs
harness Clocking_CTRL = port Clocking_CTRL
harness ETH_RGMII = port ETH_RGMII
harness SFP0 = port SFP0
harness SFP1 = port SFP1
harness SFP2 = port SFP2

### Layout directives
net class RGMII: ETH_RGMII, ETH_RGMII.RGMII_MDC, ETH_RGMII.RGMII_MDIO, ETH_RGMII.RGMII_RX_CLK, ETH_RGMII.RGMII_RX_CTL, ETH_RGMII.RGMII_RXD0, ETH_RGMII.RGMII_RXD1, ETH_RGMII.RGMII_RXD2, ETH_RGMII.RGMII_RXD3, ETH_RGMII.RGMII_TX_CLK, ETH_RGMII.RGMII_TX_CTL, ETH_RGMII.RGMII_TXD0, ETH_RGMII.RGMII_TXD1, ETH_RGMII.RGMII_TXD2, ETH_RGMII.RGMII_TXD3

### Notes on the sheet
- Bank 64 HR
- Bank 65 HR
- Project/Equipment
- Document
- Designer
- Drawn by
- Check.by
- Copyright WUT ISE 2018.
  This documentation describes Open Hardware and is licensed under the CERN OHL v.1.1. You may redistribute and modify this documentation under the terms of the CERN OHL v.1.1. (http://ohwr.org/CERNOHL). This documentation is distributed WITHOUT ANY EXPRESS OR IMPLIED WARRANTY, INCLUDING OF MERCHANTABILITY, SATISFACTORY QUALITY AND FITNESS FOR A PARTICULAR PURPOSE. Please see the CERN OHL v.1.1 for applicable conditions.
- Contact
- File
- Last Mod.
- Print Date
- Sheet
- Size
- A3
- of
- Rev
- (in symbol R0402_49R9_1%_0.0625W_100PPM) 1%
- (in symbol XCKU040-1FFVA1156C, part F) BANK 64
- (in symbol XCKU040-1FFVA1156C, part G) BANK 65

### Library data of the parts
C212 = CC0201_100NF_6.3V_10%_X5R: Non-polarised capacitor; Manufacturer: GENERIC; Part Description: SMD Multilayer Chip Ceramic Capacitor; Manufacturer1 Part Number: 02016D104KAT2A; Tolerance: ±10%; Voltage: 6.3V; TC: X5R; Manufacturer Part Number: CC0201_100NF_6.3V_10%_X5R; Part Number: CC0201_100NF_6.3V_10%_X5R; Value: 100nF; Component Kind: Standard; Component Type: Standard; Pin Count: 2; Status: Not Recommended; Case: 0201; Mounted: Yes; Socket: No; SMD: Yes; Sense: No; Manufacturer1 Example: AVX; Manufacturer1 ComponentHeight: 0.33mm; HelpURL: \\cern.ch\dfs\Applications\Altium\Datasheets\CC0201_X5R_AVX.pdf; Author: CERN DEM JLC; CreateDate: 03.12.2007; LatestRevisionDate: 03.12.2007
IC33 = XCKU040-1FFVA1156C: Kintex UltraScale FPGA, 520 I/O, 530K Cells, 1156-Ball BGA, Speed Grade 1, Commercial Grade; Manufacturer: XILINX; Part Description: Kintex UltraScale, 40 DLL I/O, 416 HP I/O, 104 HR I/O, 1156-Pin BGA, Speed Grade 1, Commercial Grade; PressFit: No; Bonding: No; Manufacturer Part Number: XCKU040-1FFVA1156C; PackageDescription: BGA, 1.00mm Pitch, Square; 1156 Pin, 34 Columns X 34 Rows, Body 35.00mm X 35.00mm X 3.50mm H, IPC Medium Density; Part Number: XCKU040-1FFVA1156C; Component Kind: Standard; Component Type: Standard; Device: XCKU040-1FFVA1156C; Pin Count: 1156; Case: BGA1156; Mounted: Yes; Socket: No; SMD: Yes; Sense: No; ComponentHeight: 3.5mm; HelpURL: \\cern.ch\dfs\Applications\Altium\Datasheets\XCKU040-1FFVA1156C.pdf; ComponentLink1URL: \\cern.ch\dfs\Applications\Altium\Datasheets\XCKU040-1FFVA1156C_Package-Pinout.pdf; ComponentLink1Description: Package/Pinout; Author: CERN DEM CA; CreateDate: 16.08.2016; LatestRevisionDate: 16.08.2016
J25 = 61001221121: WR-PHD Pin Header, SMT, pitch 2.54mm, Dual Row, Vertical, 12p; Manufacturer: Wurth Elektronik; Pin Number: 12; Rated Current: 3A; Working Voltage: 250VAC; Withstanding Voltage: 500VAC; Contact Resistance: 20mOhm; ComponentLink1Description: Manufacturer; ComponentLink1URL: http://www.we-online.de; ComponentLink2Description: Datasheet; ComponentLink2URL: https://www.we-online.com/catalog/datasheet/61001221121.pdf; Manufacturer Part Number: 61001221121; Published Date: May 2020; Pitch: 2.54mm; Operating Temperature: -40 to +125degC; Mounting Technology: SMT; Packaging: Tube; Gender: Pin Header; Row Number: Dual; Orientation: Vertical
OSC1 = OSC_50MHZ_CTS_636L3I050M00000: Oscillator 4 pins 1=OE 2=GND 3=OUT 4=VCC; Manufacturer: CTS ELECTRONIC COMPONENTS; Part Description: 3.3V, ±50ppm, 30pF, -40..85°C, HCMOS/TTL Clock Oscillator, 636 Series; PressFit: No; Bonding: No; PackageDescription: Oscillator, Side Concave; 2.54mm Pitch; 4 pin, 3.20mm L X 5.00mm W X 1.30mm H, IPC Medium Density; Part Number: OSC_50MHZ_CTS_636L3I050M00000; Value: 50MHz; Component Kind: Standard; Component Type: Standard; Pin Count: 4; Mounted: Yes; Socket: No; SMD: Yes; Sense: No; ComponentHeight: 1.3mm; HelpURL: \\cern.ch\dfs\Applications\Altium\Datasheets\OSC_CTS_636.pdf; Author: CERN DEM JMW; CreateDate: 22.09.2015; LatestRevisionDate: 22.09.2015
R232 = R0402_49R9_1%_0.0625W_100PPM: Resistor - 1%; Manufacturer: GENERIC; Part Description: General Purpose Thick Film Chip Resistor; Manufacturer1 Part Number: 232270674999L or RC0402FR-0749R9L; TC: ±100ppm/°C; PressFit: No; Manufacturer Part Number: R0402_49R9_1%_0.0625W_100PPM; Part Number: R0402_49R9_1%_0.0625W_100PPM; Tolerance: ±1%; Value: 49R9; Component Kind: Standard; Component Type: Standard; Pin Count: 2; Status: Not Recommended; Power: 0.0625W; Case: 0402; Mounted: Yes; Sense: No; Socket: No; SMD: Yes; Manufacturer1 Example: YAGEO PHYCOMP; Manufacturer1 ComponentHeight: 0.4mm; HelpURL: \\cern.ch\dfs\Applications\Altium\Datasheets\R0402_Phycomp_RC0402.pdf; Author: CERN DEM JLC; CreateDate: 24.10.2012; LatestRevisionDate: 24.10.2012

## Sheet MCH_FPGA_Banks_224_225_226_227_228.SchDoc: Metlino
size 420 x 297 mm; CheckedBy: P.Kulik,T.Przywozki,W.Ruclo; Author: G.Kasprowicz; CompanyName: WUT ISE; DrawnBy: G.Kasprowicz; Organization: WUT ISE; Address1: PW ISE; Address2: Nowowiejska 15/19 00-665 Warsaw; Address3: gkasprow@gmail.com; DocumentNumber: 8; Revision: 2; SheetNumber: 8; SheetTotal: 29; ModifiedBy: -; CheckedDate: -; Title2: FPGA banks - GTH; DivGrp: WUT ISE; Designer: G.Kasprowicz; ModifiedDate: -; ProjectName: Sensor Box
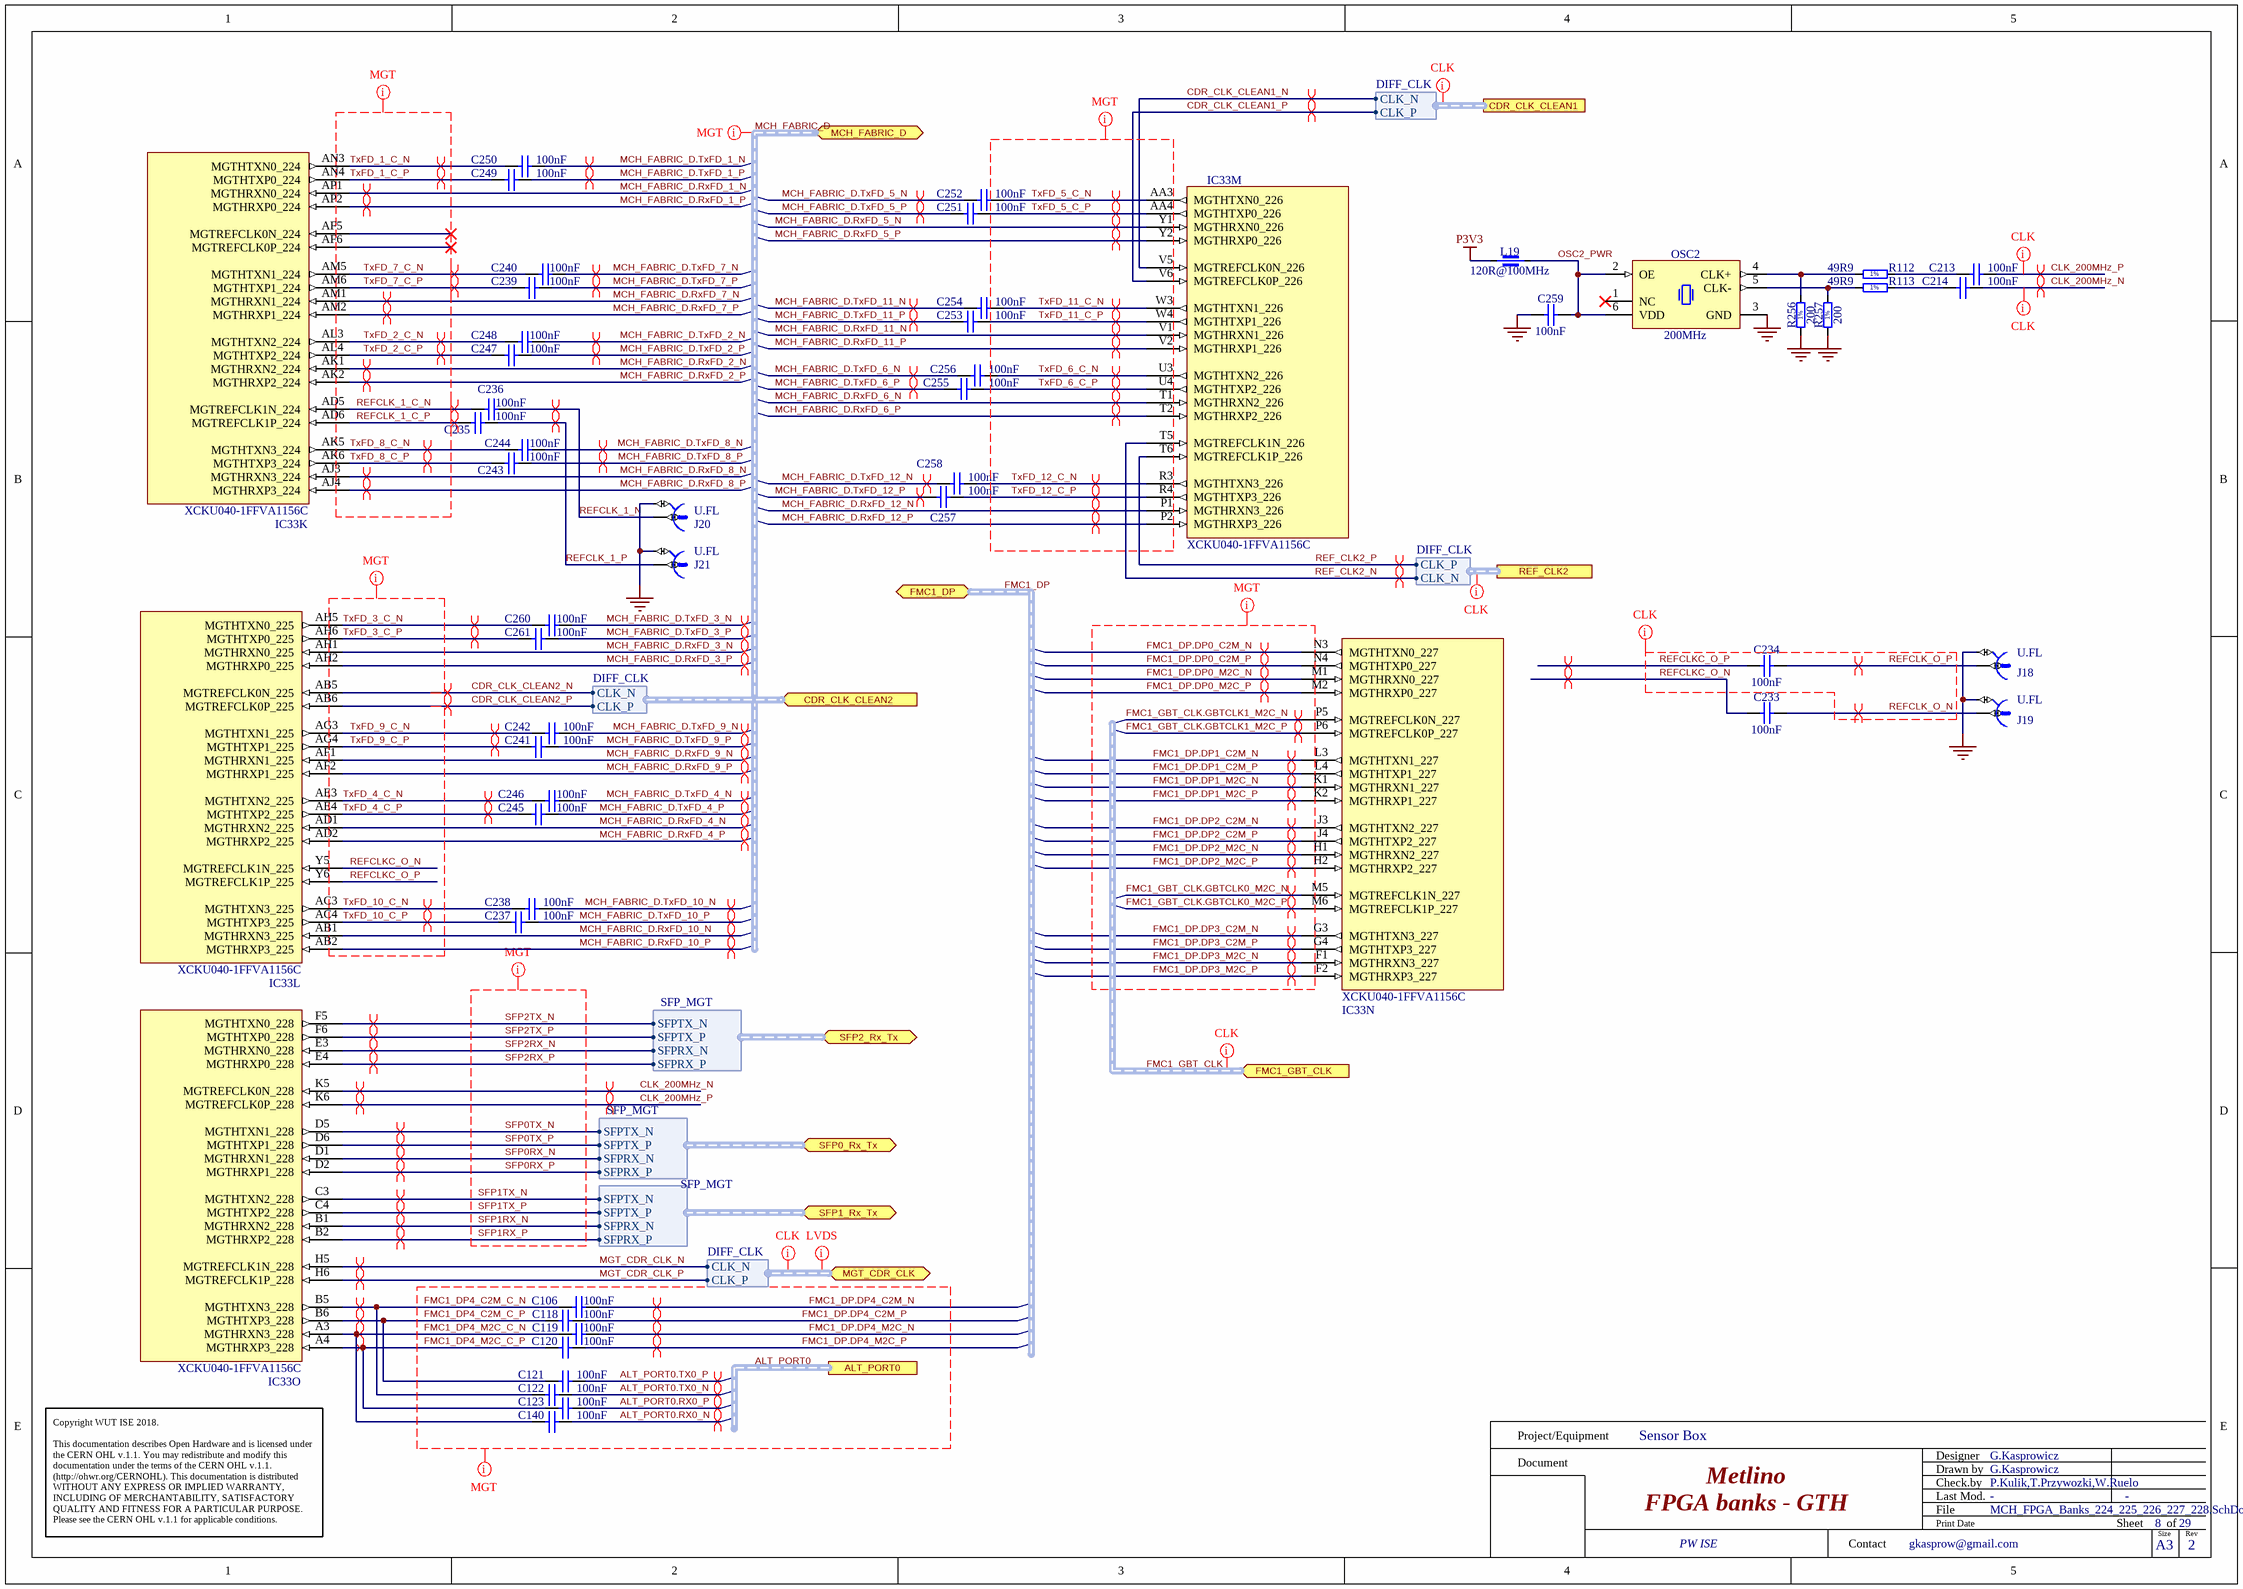
[diagram p22: MCH_FPGA_Banks_224_225_226_227_228.SchDoc]

### Parts
C106  100nF  [CAPC0603X33N]
C118  100nF  [CAPC0603X33N]
C119  100nF  [CAPC0603X33N]
C120  100nF  [CAPC0603X33N]
C121  100nF  [CAPC0603X33N]
C122  100nF  [CAPC0603X33N]
C123  100nF  [CAPC0603X33N]
C140  100nF  [CAPC0603X33N]
C213  100nF  [CAPC0603X33N]
C214  100nF  [CAPC0603X33N]
C233  100nF  [CAPC0603X33N]
C234  100nF  [CAPC0603X33N]
C235  100nF  [CAPC0603X33N]
C236  100nF  [CAPC0603X33N]
C237  100nF  [CAPC0603X33N]
C238  100nF  [CAPC0603X33N]
C239  100nF  [CAPC0603X33N]
C240  100nF  [CAPC0603X33N]
C241  100nF  [CAPC0603X33N]
C242  100nF  [CAPC0603X33N]
C243  100nF  [CAPC0603X33N]
C244  100nF  [CAPC0603X33N]
C245  100nF  [CAPC0603X33N]
C246  100nF  [CAPC0603X33N]
C247  100nF  [CAPC0603X33N]
C248  100nF  [CAPC0603X33N]
C249  100nF  [CAPC0603X33N]
C250  100nF  [CAPC0603X33N]
C251  100nF  [CAPC0603X33N]
C252  100nF  [CAPC0603X33N]
C253  100nF  [CAPC0603X33N]
C254  100nF  [CAPC0603X33N]
C255  100nF  [CAPC0603X33N]
C256  100nF  [CAPC0603X33N]
C257  100nF  [CAPC0603X33N]
C258  100nF  [CAPC0603X33N]
C259  100nF  [CAPC0603X33N]
C260  100nF  [CAPC0603X33N]
C261  100nF  [CAPC0603X33N]
IC33  XCKU040-1FFVA1156C  [BGA1156C100P34X34_3500X3500X350]  (parts K,L,M,N,O of 22)
J18  U.FL  [HIROSE_U.FL-R-SMT-1(10)]
J19  U.FL  [HIROSE_U.FL-R-SMT-1(10)]
J20  U.FL  [HIROSE_U.FL-R-SMT-1(10)]
J21  U.FL  [HIROSE_U.FL-R-SMT-1(10)]
L19  120R@100MHz  [INDC1005X55N]
OSC2  200MHz  [OSC_SILICON-LAB_SI510-6N(5X7)]
R112  49R9  [RESC1005X40N]
R113  49R9  [RESC1005X40N]
R256  200  [RESC1005X40N]
R257  200  [RESC1005X40N]

### Ports
ALT_PORT0 (harness MGTx1), CDR_CLK_CLEAN1 (harness DIFF_CLK), CDR_CLK_CLEAN2 (in, harness DIFF_CLK), FMC1_DP (bidir, harness FMC_DP), FMC1_GBT_CLK (in, harness FMC_GBT_CLK), MCH_FABRIC_D (bidir, harness MCH_FABRIC_D), MGT_CDR_CLK (bidir, harness DIFF_CLK), REF_CLK2 (harness DIFF_CLK), SFP0_Rx_Tx (bidir, harness SFP_MGT), SFP1_Rx_Tx (bidir, harness SFP_MGT), SFP2_Rx_Tx (bidir, harness SFP_MGT)

### Harnesses
DIFF_CLK: CLK_N, CLK_P
SFP_MGT: SFPRX_P, SFPRX_N, SFPTX_P, SFPTX_N

### Nets
GND: C259.1 J18.2 J19.2 J20.2 J21.2 OSC2.3(GND) R256.1 R257.1
P3V3: L19.1
ALT_PORT0.RX0_N: C140.2
ALT_PORT0.RX0_P: C123.2
ALT_PORT0.TX0_N: C122.2
ALT_PORT0.TX0_P: C121.2
CDR_CLK_CLEAN1_N: IC33.V5(MGTREFCLK0N_226) ; port CDR_CLK_CLEAN1.CLK_N
CDR_CLK_CLEAN1_P: IC33.V6(MGTREFCLK0P_226) ; port CDR_CLK_CLEAN1.CLK_P
CDR_CLK_CLEAN2_N: IC33.AB5(MGTREFCLK0N_225) ; port CDR_CLK_CLEAN2.CLK_N
CDR_CLK_CLEAN2_P: IC33.AB6(MGTREFCLK0P_225) ; port CDR_CLK_CLEAN2.CLK_P
CLK_200MHz_N: C214.2 IC33.K5(MGTREFCLK0N_228)
CLK_200MHz_P: C213.2 IC33.K6(MGTREFCLK0P_228)
FMC1_DP4_C2M_C_N: C106.1 C122.1 IC33.B5(MGTHTXN3_228)
FMC1_DP4_C2M_C_P: C118.1 C121.1 IC33.B6(MGTHTXP3_228)
FMC1_DP4_M2C_C_N: C119.1 C140.1 IC33.A3(MGTHRXN3_228)
FMC1_DP4_M2C_C_P: C120.1 C123.1 IC33.A4(MGTHRXP3_228)
FMC1_DP.DP0_C2M_N: IC33.N3(MGTHTXN0_227)
FMC1_DP.DP0_C2M_P: IC33.N4(MGTHTXP0_227)
FMC1_DP.DP0_M2C_N: IC33.M1(MGTHRXN0_227)
FMC1_DP.DP0_M2C_P: IC33.M2(MGTHRXP0_227)
FMC1_DP.DP1_C2M_N: IC33.L3(MGTHTXN1_227)
FMC1_DP.DP1_C2M_P: IC33.L4(MGTHTXP1_227)
FMC1_DP.DP1_M2C_N: IC33.K1(MGTHRXN1_227)
FMC1_DP.DP1_M2C_P: IC33.K2(MGTHRXP1_227)
FMC1_DP.DP2_C2M_N: IC33.J3(MGTHTXN2_227)
FMC1_DP.DP2_C2M_P: IC33.J4(MGTHTXP2_227)
FMC1_DP.DP2_M2C_N: IC33.H1(MGTHRXN2_227)
FMC1_DP.DP2_M2C_P: IC33.H2(MGTHRXP2_227)
FMC1_DP.DP3_C2M_N: IC33.G3(MGTHTXN3_227)
FMC1_DP.DP3_C2M_P: IC33.G4(MGTHTXP3_227)
FMC1_DP.DP3_M2C_N: IC33.F1(MGTHRXN3_227)
FMC1_DP.DP3_M2C_P: IC33.F2(MGTHRXP3_227)
FMC1_DP.DP4_C2M_N: C106.2
FMC1_DP.DP4_C2M_P: C118.2
FMC1_DP.DP4_M2C_N: C119.2
FMC1_DP.DP4_M2C_P: C120.2
FMC1_GBT_CLK.GBTCLK0_M2C_N: IC33.M5(MGTREFCLK1N_227)
FMC1_GBT_CLK.GBTCLK0_M2C_P: IC33.M6(MGTREFCLK1P_227)
FMC1_GBT_CLK.GBTCLK1_M2C_N: IC33.P5(MGTREFCLK0N_227)
FMC1_GBT_CLK.GBTCLK1_M2C_P: IC33.P6(MGTREFCLK0P_227)
MCH_FABRIC_D.RxFD_1_N: IC33.AP1(MGTHRXN0_224)
MCH_FABRIC_D.RxFD_1_P: IC33.AP2(MGTHRXP0_224)
MCH_FABRIC_D.RxFD_2_N: IC33.AK1(MGTHRXN2_224)
MCH_FABRIC_D.RxFD_2_P: IC33.AK2(MGTHRXP2_224)
MCH_FABRIC_D.RxFD_3_N: IC33.AH1(MGTHRXN0_225)
MCH_FABRIC_D.RxFD_3_P: IC33.AH2(MGTHRXP0_225)
MCH_FABRIC_D.RxFD_4_N: IC33.AD1(MGTHRXN2_225)
MCH_FABRIC_D.RxFD_4_P: IC33.AD2(MGTHRXP2_225)
MCH_FABRIC_D.RxFD_5_N: IC33.Y1(MGTHRXN0_226)
MCH_FABRIC_D.RxFD_5_P: IC33.Y2(MGTHRXP0_226)
MCH_FABRIC_D.RxFD_6_N: IC33.T1(MGTHRXN2_226)
MCH_FABRIC_D.RxFD_6_P: IC33.T2(MGTHRXP2_226)
MCH_FABRIC_D.RxFD_7_N: IC33.AM1(MGTHRXN1_224)
MCH_FABRIC_D.RxFD_7_P: IC33.AM2(MGTHRXP1_224)
MCH_FABRIC_D.RxFD_8_N: IC33.AJ3(MGTHRXN3_224)
MCH_FABRIC_D.RxFD_8_P: IC33.AJ4(MGTHRXP3_224)
MCH_FABRIC_D.RxFD_9_N: IC33.AF1(MGTHRXN1_225)
MCH_FABRIC_D.RxFD_9_P: IC33.AF2(MGTHRXP1_225)
MCH_FABRIC_D.RxFD_10_N: IC33.AB1(MGTHRXN3_225)
MCH_FABRIC_D.RxFD_10_P: IC33.AB2(MGTHRXP3_225)
MCH_FABRIC_D.RxFD_11_N: IC33.V1(MGTHRXN1_226)
MCH_FABRIC_D.RxFD_11_P: IC33.V2(MGTHRXP1_226)
MCH_FABRIC_D.RxFD_12_N: IC33.P1(MGTHRXN3_226)
MCH_FABRIC_D.RxFD_12_P: IC33.P2(MGTHRXP3_226)
MCH_FABRIC_D.TxFD_1_N: C250.2
MCH_FABRIC_D.TxFD_1_P: C249.2
MCH_FABRIC_D.TxFD_2_N: C248.2
MCH_FABRIC_D.TxFD_2_P: C247.2
MCH_FABRIC_D.TxFD_3_N: C260.2
MCH_FABRIC_D.TxFD_3_P: C261.2
MCH_FABRIC_D.TxFD_4_N: C246.2
MCH_FABRIC_D.TxFD_4_P: C245.2
MCH_FABRIC_D.TxFD_5_N: C252.1
MCH_FABRIC_D.TxFD_5_P: C251.1
MCH_FABRIC_D.TxFD_6_N: C256.1
MCH_FABRIC_D.TxFD_6_P: C255.1
MCH_FABRIC_D.TxFD_7_N: C240.2
MCH_FABRIC_D.TxFD_7_P: C239.2
MCH_FABRIC_D.TxFD_8_N: C244.2
MCH_FABRIC_D.TxFD_8_P: C243.2
MCH_FABRIC_D.TxFD_9_N: C242.2
MCH_FABRIC_D.TxFD_9_P: C241.2
MCH_FABRIC_D.TxFD_10_N: C238.2
MCH_FABRIC_D.TxFD_10_P: C237.2
MCH_FABRIC_D.TxFD_11_N: C254.1
MCH_FABRIC_D.TxFD_11_P: C253.1
MCH_FABRIC_D.TxFD_12_N: C258.1
MCH_FABRIC_D.TxFD_12_P: C257.1
MGT_CDR_CLK_N: IC33.H5(MGTREFCLK1N_228) ; port MGT_CDR_CLK.CLK_N
MGT_CDR_CLK_P: IC33.H6(MGTREFCLK1P_228) ; port MGT_CDR_CLK.CLK_P
OSC2_PWR: C259.2 L19.2 OSC2.2(OE) OSC2.6(VDD)
REF_CLK2_N: IC33.T5(MGTREFCLK1N_226) ; port REF_CLK2.CLK_N
REF_CLK2_P: IC33.T6(MGTREFCLK1P_226) ; port REF_CLK2.CLK_P
REFCLK_1_C_N: C236.1 IC33.AD5(MGTREFCLK1N_224)
REFCLK_1_C_P: C235.1 IC33.AD6(MGTREFCLK1P_224)
REFCLK_1_N: C236.2 J20.1
REFCLK_1_P: C235.2 J21.1
REFCLK_O_N: C233.2 J19.1
REFCLK_O_P: C234.2 J18.1
REFCLKC_O_N: C233.1 IC33.Y5(MGTREFCLK1N_225)
REFCLKC_O_P: C234.1 IC33.Y6(MGTREFCLK1P_225)
SFP0RX_N: IC33.D1(MGTHRXN1_228) ; port SFP0_Rx_Tx.SFPRX_N
SFP0RX_P: IC33.D2(MGTHRXP1_228) ; port SFP0_Rx_Tx.SFPRX_P
SFP0TX_N: IC33.D5(MGTHTXN1_228) ; port SFP0_Rx_Tx.SFPTX_N
SFP0TX_P: IC33.D6(MGTHTXP1_228) ; port SFP0_Rx_Tx.SFPTX_P
SFP1RX_N: IC33.B1(MGTHRXN2_228) ; port SFP1_Rx_Tx.SFPRX_N
SFP1RX_P: IC33.B2(MGTHRXP2_228) ; port SFP1_Rx_Tx.SFPRX_P
SFP1TX_N: IC33.C3(MGTHTXN2_228) ; port SFP1_Rx_Tx.SFPTX_N
SFP1TX_P: IC33.C4(MGTHTXP2_228) ; port SFP1_Rx_Tx.SFPTX_P
SFP2RX_N: IC33.E3(MGTHRXN0_228) ; port SFP2_Rx_Tx.SFPRX_N
SFP2RX_P: IC33.E4(MGTHRXP0_228) ; port SFP2_Rx_Tx.SFPRX_P
SFP2TX_N: IC33.F5(MGTHTXN0_228) ; port SFP2_Rx_Tx.SFPTX_N
SFP2TX_P: IC33.F6(MGTHTXP0_228) ; port SFP2_Rx_Tx.SFPTX_P
TxFD_1_C_N: C250.1 IC33.AN3(MGTHTXN0_224)
TxFD_1_C_P: C249.1 IC33.AN4(MGTHTXP0_224)
TxFD_2_C_N: C248.1 IC33.AL3(MGTHTXN2_224)
TxFD_2_C_P: C247.1 IC33.AL4(MGTHTXP2_224)
TxFD_3_C_N: C260.1 IC33.AH5(MGTHTXN0_225)
TxFD_3_C_P: C261.1 IC33.AH6(MGTHTXP0_225)
TxFD_4_C_N: C246.1 IC33.AE3(MGTHTXN2_225)
TxFD_4_C_P: C245.1 IC33.AE4(MGTHTXP2_225)
TxFD_5_C_N: C252.2 IC33.AA3(MGTHTXN0_226)
TxFD_5_C_P: C251.2 IC33.AA4(MGTHTXP0_226)
TxFD_6_C_N: C256.2 IC33.U3(MGTHTXN2_226)
TxFD_6_C_P: C255.2 IC33.U4(MGTHTXP2_226)
TxFD_7_C_N: C240.1 IC33.AM5(MGTHTXN1_224)
TxFD_7_C_P: C239.1 IC33.AM6(MGTHTXP1_224)
TxFD_8_C_N: C244.1 IC33.AK5(MGTHTXN3_224)
TxFD_8_C_P: C243.1 IC33.AK6(MGTHTXP3_224)
TxFD_9_C_N: C242.1 IC33.AG3(MGTHTXN1_225)
TxFD_9_C_P: C241.1 IC33.AG4(MGTHTXP1_225)
TxFD_10_C_N: C238.1 IC33.AC3(MGTHTXN3_225)
TxFD_10_C_P: C237.1 IC33.AC4(MGTHTXP3_225)
TxFD_11_C_N: C254.2 IC33.W3(MGTHTXN1_226)
TxFD_11_C_P: C253.2 IC33.W4(MGTHTXP1_226)
TxFD_12_C_N: C258.2 IC33.R3(MGTHTXN3_226)
TxFD_12_C_P: C257.2 IC33.R4(MGTHTXP3_226)
NetC213_1: C213.1 R112.2
NetC214_1: C214.1 R113.2
NetOSC2_4: OSC2.4(CLK+) R112.1 R256.2
NetOSC2_5: OSC2.5(CLK-) R113.1 R257.2

Not connected (* = marked no-connect by the designer): IC33 AF5(MGTREFCLK0N_224)* AF6(MGTREFCLK0P_224)*; OSC2 1(NC)*

### Buses and harness runs
harness ALT_PORT0 = port ALT_PORT0
harness FMC1_DP = port FMC1_DP
harness FMC1_GBT_CLK = port FMC1_GBT_CLK
harness MCH_FABRIC_D = port MCH_FABRIC_D

### Layout directives
differential pair: ALT_PORT0.RX0_N, ALT_PORT0.RX0_P, ALT_PORT0.TX0_N, ALT_PORT0.TX0_P, CDR_CLK_CLEAN1_N, CDR_CLK_CLEAN1_P, CDR_CLK_CLEAN2_N, CDR_CLK_CLEAN2_P, CLK_200MHz_N, CLK_200MHz_P, FMC1_DP4_C2M_C_N, FMC1_DP4_C2M_C_P, FMC1_DP4_M2C_C_N, FMC1_DP4_M2C_C_P, FMC1_DP.DP0_C2M_N, FMC1_DP.DP0_C2M_P, FMC1_DP.DP0_M2C_N, FMC1_DP.DP0_M2C_P, FMC1_DP.DP1_C2M_N, FMC1_DP.DP1_C2M_P, FMC1_DP.DP1_M2C_N, FMC1_DP.DP1_M2C_P, FMC1_DP.DP2_C2M_N, FMC1_DP.DP2_C2M_P, FMC1_DP.DP2_M2C_N, FMC1_DP.DP2_M2C_P, FMC1_DP.DP3_C2M_N, FMC1_DP.DP3_C2M_P, FMC1_DP.DP3_M2C_N, FMC1_DP.DP3_M2C_P, FMC1_DP.DP4_C2M_N, FMC1_DP.DP4_C2M_P, FMC1_DP.DP4_M2C_N, FMC1_DP.DP4_M2C_P, FMC1_GBT_CLK.GBTCLK0_M2C_N, FMC1_GBT_CLK.GBTCLK0_M2C_P, FMC1_GBT_CLK.GBTCLK1_M2C_N, FMC1_GBT_CLK.GBTCLK1_M2C_P, MCH_FABRIC_D.RxFD_1_N, MCH_FABRIC_D.RxFD_1_P, MCH_FABRIC_D.RxFD_2_N, MCH_FABRIC_D.RxFD_2_P, MCH_FABRIC_D.RxFD_3_N, MCH_FABRIC_D.RxFD_3_P, MCH_FABRIC_D.RxFD_4_N, MCH_FABRIC_D.RxFD_4_P, MCH_FABRIC_D.RxFD_5_N, MCH_FABRIC_D.RxFD_5_P, MCH_FABRIC_D.RxFD_6_N, MCH_FABRIC_D.RxFD_6_P, MCH_FABRIC_D.RxFD_7_N, MCH_FABRIC_D.RxFD_7_P, MCH_FABRIC_D.RxFD_8_N, MCH_FABRIC_D.RxFD_8_P, MCH_FABRIC_D.RxFD_9_N, MCH_FABRIC_D.RxFD_9_P, MCH_FABRIC_D.RxFD_10_N, MCH_FABRIC_D.RxFD_10_P, MCH_FABRIC_D.RxFD_11_N, MCH_FABRIC_D.RxFD_11_P, MCH_FABRIC_D.RxFD_12_N, MCH_FABRIC_D.RxFD_12_P, MCH_FABRIC_D.TxFD_1_N, MCH_FABRIC_D.TxFD_1_P, MCH_FABRIC_D.TxFD_2_N, MCH_FABRIC_D.TxFD_2_P, MCH_FABRIC_D.TxFD_3_N, MCH_FABRIC_D.TxFD_3_P, MCH_FABRIC_D.TxFD_4_N, MCH_FABRIC_D.TxFD_4_P, MCH_FABRIC_D.TxFD_5_N, MCH_FABRIC_D.TxFD_5_P, MCH_FABRIC_D.TxFD_6_N, MCH_FABRIC_D.TxFD_6_P, MCH_FABRIC_D.TxFD_7_N, MCH_FABRIC_D.TxFD_7_P, MCH_FABRIC_D.TxFD_8_N, MCH_FABRIC_D.TxFD_8_P, MCH_FABRIC_D.TxFD_9_N, MCH_FABRIC_D.TxFD_9_P, MCH_FABRIC_D.TxFD_10_N, MCH_FABRIC_D.TxFD_10_P, MCH_FABRIC_D.TxFD_11_N, MCH_FABRIC_D.TxFD_11_P, MCH_FABRIC_D.TxFD_12_N, MCH_FABRIC_D.TxFD_12_P, MGT_CDR_CLK_N, MGT_CDR_CLK_P, REF_CLK2_N, REF_CLK2_P, REFCLK_1_C_N, REFCLK_1_C_P, REFCLK_1_N, REFCLK_1_P, REFCLK_O_N, REFCLK_O_P, REFCLKC_O_N, REFCLKC_O_P, SFP0RX_N, SFP0RX_P, SFP0TX_N, SFP0TX_P, SFP1RX_N, SFP1RX_P, SFP1TX_N, SFP1TX_P, SFP2RX_N, SFP2RX_P, SFP2TX_N, SFP2TX_P, TxFD_1_C_N, TxFD_1_C_P, TxFD_2_C_N, TxFD_2_C_P, TxFD_3_C_N, TxFD_3_C_P, TxFD_4_C_N, TxFD_4_C_P, TxFD_5_C_N, TxFD_5_C_P, TxFD_6_C_N, TxFD_6_C_P, TxFD_7_C_N, TxFD_7_C_P, TxFD_8_C_N, TxFD_8_C_P, TxFD_9_C_N, TxFD_9_C_P, TxFD_10_C_N, TxFD_10_C_P, TxFD_11_C_N, TxFD_11_C_P, TxFD_12_C_N, TxFD_12_C_P
net class MGT: (no net found under the mark), ALT_PORT0, ALT_PORT0.RX0_N, ALT_PORT0.RX0_P, ALT_PORT0.TX0_N, ALT_PORT0.TX0_P, FMC1_DP4_C2M_C_N, FMC1_DP4_C2M_C_P, FMC1_DP4_M2C_C_N, FMC1_DP4_M2C_C_P, FMC1_DP.DP0_C2M_N, FMC1_DP.DP0_C2M_P, FMC1_DP.DP0_M2C_N, FMC1_DP.DP0_M2C_P, FMC1_DP.DP1_C2M_N, FMC1_DP.DP1_C2M_P, FMC1_DP.DP1_M2C_N, FMC1_DP.DP1_M2C_P, FMC1_DP.DP2_C2M_N, FMC1_DP.DP2_C2M_P, FMC1_DP.DP2_M2C_N, FMC1_DP.DP2_M2C_P, FMC1_DP.DP3_C2M_N, FMC1_DP.DP3_C2M_P, FMC1_DP.DP3_M2C_N, FMC1_DP.DP3_M2C_P, FMC1_DP.DP4_C2M_N, FMC1_DP.DP4_C2M_P, FMC1_DP.DP4_M2C_N, FMC1_DP.DP4_M2C_P, FMC1_GBT_CLK.GBTCLK0_M2C_N, FMC1_GBT_CLK.GBTCLK0_M2C_P, FMC1_GBT_CLK.GBTCLK1_M2C_N, FMC1_GBT_CLK.GBTCLK1_M2C_P, REFCLK_1_C_N, REFCLK_1_C_P, REFCLKC_O_N, REFCLKC_O_P, SFP0RX_N, SFP0RX_P, SFP0TX_N, SFP0TX_P, SFP1RX_N, SFP1RX_P, SFP1TX_N, SFP1TX_P, SFP2RX_N, SFP2RX_P, SFP2TX_N, SFP2TX_P, TxFD_1_C_N, TxFD_1_C_P, TxFD_2_C_N, TxFD_2_C_P, TxFD_3_C_N, TxFD_3_C_P, TxFD_4_C_N, TxFD_4_C_P, TxFD_5_C_N, TxFD_5_C_P, TxFD_6_C_N, TxFD_6_C_P, TxFD_7_C_N, TxFD_7_C_P, TxFD_8_C_N, TxFD_8_C_P, TxFD_9_C_N, TxFD_9_C_P, TxFD_10_C_N, TxFD_10_C_P, TxFD_11_C_N, TxFD_11_C_P, TxFD_12_C_N, TxFD_12_C_P
net class CLK: (no net found under the mark), CLK_200MHz_N, CLK_200MHz_P, REFCLK_O_N, REFCLK_O_P, REFCLKC_O_N, REFCLKC_O_P
net class LVDS: (no net found under the mark)

### Notes on the sheet
- Project/Equipment
- Document
- Designer
- Drawn by
- Check.by
- Copyright WUT ISE 2018.
  This documentation describes Open Hardware and is licensed under the CERN OHL v.1.1. You may redistribute and modify this documentation under the terms of the CERN OHL v.1.1. (http://ohwr.org/CERNOHL). This documentation is distributed WITHOUT ANY EXPRESS OR IMPLIED WARRANTY, INCLUDING OF MERCHANTABILITY, SATISFACTORY QUALITY AND FITNESS FOR A PARTICULAR PURPOSE. Please see the CERN OHL v.1.1 for applicable conditions.
- Contact
- File
- Last Mod.
- Print Date
- Sheet
- Size
- A3
- of
- Rev
- (in symbol R0402_49R9_1%_0.0625W_100PPM) 1%
- (in symbol R0402_200R_1%_0.0625W_100PPM) 1%

### Library data of the parts
C106 C118-C123 C140 C213 C214 C233-C261 = CC0201_100NF_6.3V_10%_X5R: as C212 on sheet MCH_FPGA_Banks_64_65_HR; Manufacturer Part Number: CC0201_100NF_6.3V_10%_X5R; Part Number: CC0201_100NF_6.3V_10%_X5R; Value: 100nF; Component Kind: Standard; Component Type: Standard; Pin Count: 2; Status: Not Recommended; Case: 0201; Mounted: Yes; Socket: No; SMD: Yes; Sense: No; Manufacturer1 Example: AVX; Manufacturer1 ComponentHeight: 0.33mm; HelpURL: \\cern.ch\dfs\Applications\Altium\Datasheets\CC0201_X5R_AVX.pdf; Author: CERN DEM JLC; CreateDate: 03.12.2007; LatestRevisionDate: 03.12.2007
IC33 = XCKU040-1FFVA1156C: as IC33 on sheet MCH_FPGA_Banks_64_65_HR; PackageDescription: BGA, 1.00mm Pitch, Square; 1156 Pin, 34 Columns X 34 Rows, Body 35.00mm X 35.00mm X 3.50mm H, IPC Medium Density; Part Number: XCKU040-1FFVA1156C; Component Kind: Standard; Component Type: Standard; Device: XCKU040-1FFVA1156C; Manufacturer Part Number: XCKU040-1FFVA1156C; Pin Count: 1156; Case: BGA1156; Mounted: Yes; Socket: No; SMD: Yes; Sense: No; ComponentHeight: 3.5mm; HelpURL: \\cern.ch\dfs\Applications\Altium\Datasheets\XCKU040-1FFVA1156C.pdf; ComponentLink1URL: \\cern.ch\dfs\Applications\Altium\Datasheets\XCKU040-1FFVA1156C_Package-Pinout.pdf; ComponentLink1Description: Package/Pinout; Author: CERN DEM CA; CreateDate: 16.08.2016; LatestRevisionDate: 16.08.2016
J18-J21 = HIROSE_U.FL-R-SMT-1(10): Manufacturer: HIROSE (HRS); Part Description: Up to 6GHz Ultra Small Surface Mount Male Coaxial Connectors U.FL Series; PressFit: No; Manufacturer Part Number: U.FL-R-SMT-1(10); Part Number: HIROSE_U.FL-R-SMT-1(10); Component Kind: Standard; Component Type: Standard; Pin Count: 2; Family: U.FL; Mounted: Yes; Socket: No; SMD: Yes; Sense: No; Status: None; ComponentHeight: 1.25mm; HelpURL: \\cern.ch\dfs\Applications\Altium\Datasheets\HIROSE_U.FL-R-SMT-1(10).pdf; Author: CERN DEM JLC; CreateDate: 24.03.2010; LatestRevisionDate: 24.03.2010
L19 = IND0402_MURATA_BLM15PX121SN1D: Manufacturer: MURATA; Part Description: SMD EMIFIL Chip Ferrite Bead; Tolerance: ±25%; Power: 2A; Resistance: 0.055R; Manufacturer Part Number: BLM15PX121SN1D; Part Number: IND0402_MURATA_BLM15PX121SN1D; Value: 120R@100MHz; Component Kind: Standard; Component Type: Standard; Pin Count: 2; Status: None; Case: 0402; Mounted: Yes; Socket: No; SMD: Yes; Sense: No; ComponentHeight: 0.55mm; HelpURL: \\cern.ch\dfs\Applications\Altium\Datasheets\IND0402_MURATA_BLM15PX.pdf; Author: CERN DEM JMW; CreateDate: 19.02.2014; LatestRevisionDate: 25.10.2018
OSC2 = OSC_200MHZ_SILICON-LAB_510ABA200M000AAG: Crystal Oscillator 6 pins, Si510 (LVDS/LVPECL/HCSL/Dual CMOS); Manufacturer: SILICON LABS; Part Description: crystal oscillator, 200MHz, 100ppm, 3.3V, LVDS, 5x7mm; PressFit: No; Bonding: No; Manufacturer Part Number: 510ABA200M000AAG; PackageDescription: Oscillator Si510 Series, 6 pins, 5x7mm; Part Number: OSC_200MHZ_SILICON-LAB_510ABA200M000AAG; Value: 200MHz; Component Kind: Standard; Component Type: Standard; Pin Count: 6; Mounted: Yes; Socket: No; SMD: Yes; Sense: No; ComponentHeight: 1.8mm; HelpURL: \\cern.ch\dfs\Applications\Altium\Datasheets\OSC_SILICON-LAB_SI510.pdf; Author: GK; CreateDate: 10.08.2015; LatestRevisionDate: 26.11.2018
R112 R113 = R0402_49R9_1%_0.0625W_100PPM: Resistor - 1%; Part Description: General Purpose Thick Film Chip Resistor; Manufacturer: GENERIC; Manufacturer1 Part Number: 232270674999L or RC0402FR-0749R9L; TC: ±100ppm/°C; PressFit: No; Part Number: R0402_49R9_1%_0.0625W_100PPM; Component Kind: Standard; Component Type: Standard; Pin Count: 2; Value: 49R9; Status: Not Recommended; Power: 0.0625W; Tolerance: ±1%; Manufacturer Part Number: R0402_49R9_1%_0.0625W_100PPM; Case: 0402; Mounted: Yes; Sense: No; Socket: No; SMD: Yes; Manufacturer1 Example: YAGEO PHYCOMP; Manufacturer1 ComponentHeight: 0.4mm; HelpURL: \\cern.ch\dfs\Applications\Altium\Datasheets\R0402_Phycomp_RC0402.pdf; Author: CERN DEM JLC; CreateDate: 24.10.2012; LatestRevisionDate: 24.10.2012
R256 R257 = R0402_200R_1%_0.0625W_100PPM: Resistor - 1%; Manufacturer: GENERIC; Part Description: General Purpose Thick Film Chip Resistor; Manufacturer1 Part Number: 232270672001L; TC: ±100ppm/°C; PressFit: No; Manufacturer Part Number: R0402_200R_1%_0.0625W_100PPM; Part Number: R0402_200R_1%_0.0625W_100PPM; Tolerance: ±1%; Value: 200; Component Kind: Standard; Component Type: Standard; Pin Count: 2; Status: Not Recommended; Power: 0.0625W; Case: 0402; Mounted: Yes; Sense: No; Socket: No; SMD: Yes; Manufacturer1 Example: YAGEO PHYCOMP; Manufacturer1 ComponentHeight: 0.4mm; HelpURL: \\cern.ch\dfs\Applications\Altium\Datasheets\R0402_Phycomp_RC0402.pdf; Author: CERN DEM JLC; CreateDate: 03.12.2007; LatestRevisionDate: 17.10.2012